# Altium project DAL_OBC_V10.PrjPcb (part 3 of 9)
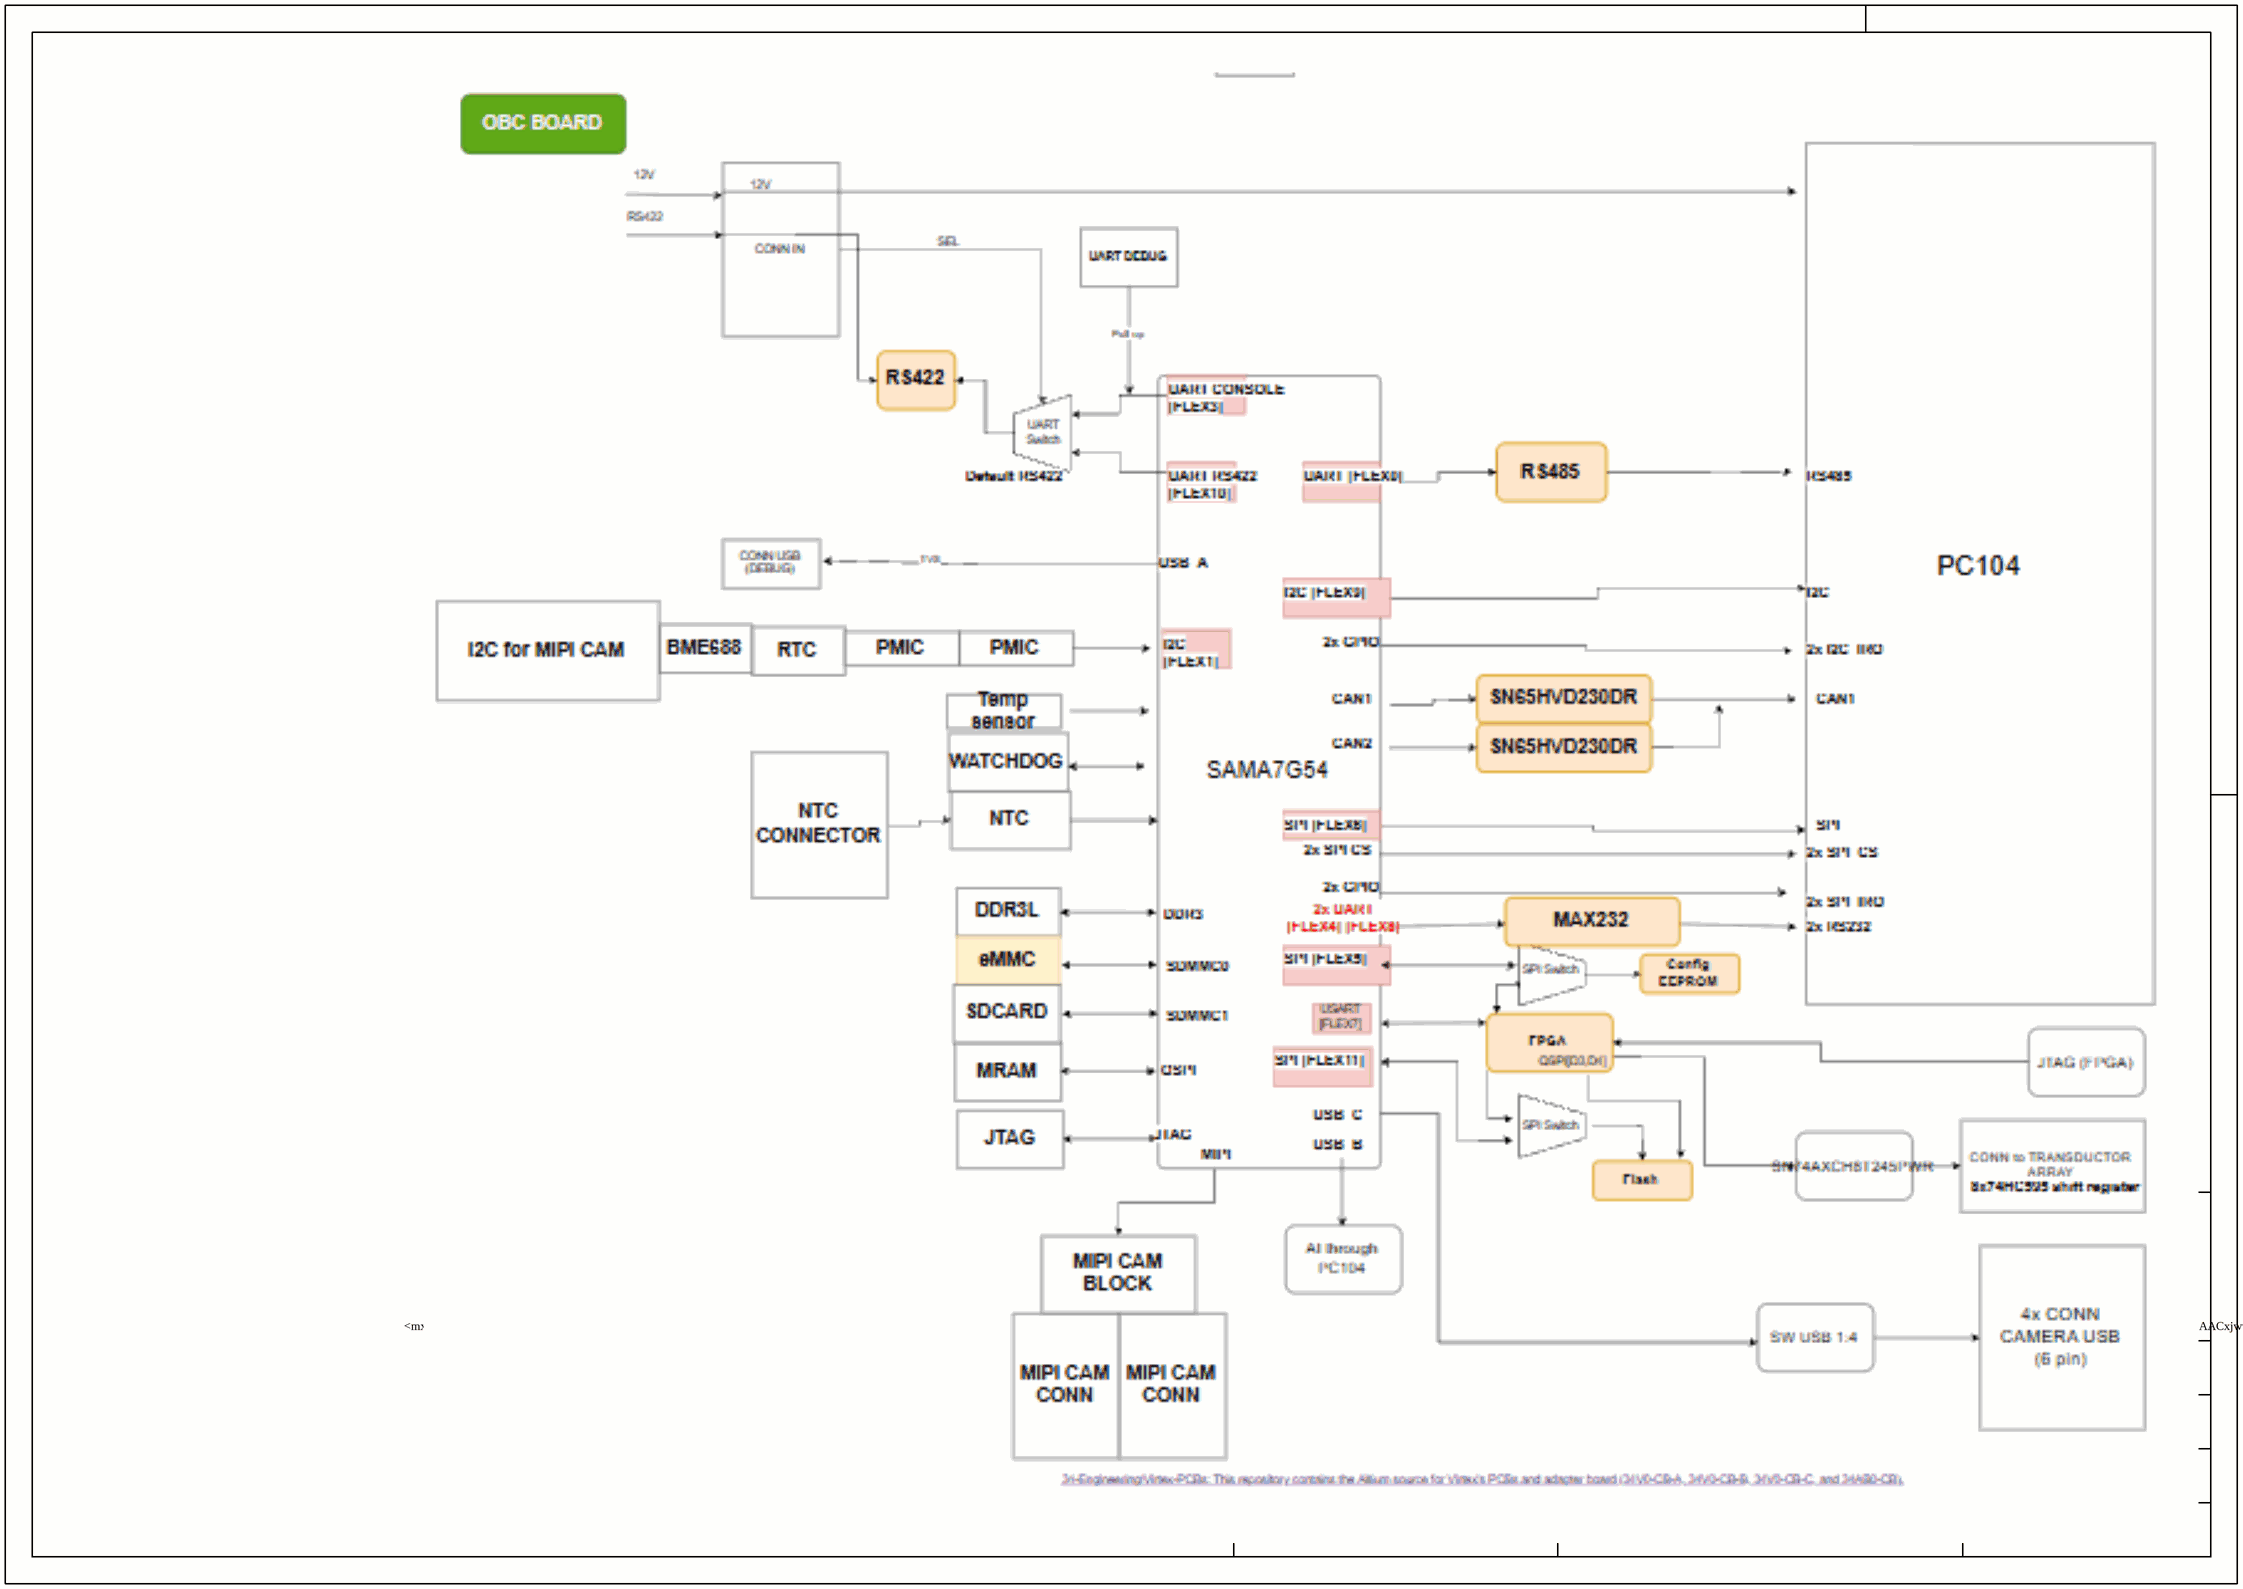
[diagram p36: BlockDiagram.SchDoc]

## Sheet BlockDiagram.SchDoc (continued)

### Notes on the sheet (continued)
JqvcTMV7Viu/XVq8e4P+ysQOpsY+cgftl/CTTGbK1QFBlSKSDqOwohJNKsQKHWWHbZzwsWz9ZQRYEslc7zK4TY5hW1xpJVG/St9bheu8T31fUY6Pg5Rfu2CP3aGnDN+aqy3LYfB0Pe8wbq2GzIe2Ubc1++foxoIiK6HAM1nyaiJixDdA2Yz69L36bTRERE5+Z7VrmQmmIiIiL6HnK8nnhEAiIionNiUExEREThOo9NTEREdNkYFBMREVGwamzirxlSioiIaGgMiomIiChQic+P3T87dWxGRER0udjRFtGJsQzRNWA+JyIiokvme1ZhTTERERERERFdLQbFREREREREdLUYFBMREREREdHVYlBMREREREREV2v0798/99fGO//995/9JyIiIiIiIqJv5d+/f/afAPY+TXR6LEN0DZjPiYiI6JL5nlXYfJqIiIiIiIiuFoNiIiIiIiIiuloMiomIiIiIiOhqMSgmIiIiIiKiq8WgmIiIiIiIiK4Wg2IiIiIiIiK6WgyKiYiIiIiI6GoxKCYiIiIiIqKrxaCYiIiIiIiIrhaDYiIiIiIiIrpaDIqJiIiIiIjoajEoJiIiIiIioqs1UFBcYhGNMBqFTdGitJbPkex/jxawf/Xrtu7RKEHesGx9u1y0bTXSalDmWCQRImsboyhCsshRhqxyr8yxSJJaWqNRhChKtunZyzjVj1mUtO5Jo3wRmdvT+RzaSpT5AklkpxshSjoes++iPLIM5El1DoPyL+rnPwrIxwf1vGNPh7xtL7qTJ/VlOk098ip9tfb8sy3nCRZ52ZiH6gLSNSZXnm9PI/i6fdbyDJT5wnmfOe5YBvoO97YoQdBh1M9X6/WlRL6ob+vX7veR+Q2oH7PWyVV2iIh+ANUiYBalVKYkoBA4ibRoXl6kyv7Vr9u6AaGM1WdS+02qTPvJJZO+/dAUmZLCXrd7ErJlnzuktU0v86fXcMxk2867FKkStbTaj2MjZ3r2JI7b1i+CkDKk73eXMqDlX29+1DmOcfjxdOcd9ySUdGyTXoaOmrocHzobhOTzTvkHuzzUdj1TR6Vbz5pd0hBKZrUEKmcqz0Uma2W5eXKXx8463I8u4t4Wcvz18+W5GIYeb08SW6fc75D9NTiOmXdylR0iou8BnmeVkdrO0Gg0GqFllt1byilWAAABKW/tGQz3T0vEY/0v2vIiRbGewfjZS19WIn2+x409i2GC2Fh5iUU0wXyz+6/MoJax9rumXCCazLGdVSJTSzjnNObbExDyFtsj84GP1cb4XaQF1jPHXucJounKkxbw8bHCxpyh5Tjq50vjXcYtT0aYbg8+hNjstsNzbHys4yZkiuenO0wAAAX+vL5gvjr8irRYw3XILk1QGdL3vct5yBOMtiegOQ9ZykWEySHD7wSv01/ePt/f8bYy86vMFPQiVeYJXt+1GQ70cmHmccP9E5bmBYQuQFA+b8k/+HzH+98PrA7lfKc1f7akW2PfB9CaxufnO97m/rx9cPLybN239oSAvK1KzcfHBzbWzcGfbotvem9rPE97+n41PQNo5wbY5ZGHe9zc7PLt2wr7bNu4zzjDfnvnc/Hn+zpX2SEi+h68zyp2lGwLmKXnW0rVc/k+y+4YNWdNb0ELlWpvdpvfBFtvXYVUaeFMUKkiU6kU2/lcCdo1ekKq5sqJQmX7tPaTK02lrGMmtTfWTfveREtHptrxOaam2Dy+TbUkhV6zf+z5PjOElKEz1SwZx/mocx9S3gqrNjg0P+hlJ3QZuhRB+Two/6htHkqtWjnv/KHp+oSkYeXtpvlOWp7NayUCahKLLD2U9eZ023y3e5vQ1tFyPWmtKQ67P21rgIXn93Psd4f8plTPZYmIvhd4nlUG+qb4mxvP8Cz3/9lg/uj4Jid/rd7KixRPjhfJAJAn2ltqkaJYLzEbN7xVHceYLdcoshTpvZ1gicWj9kZ+l1bzC9ox4uUaRSqqP61eAr6n+oWnw85v8PandYGDcvFyaB2QPt3ZP3djHd/fDW/Zx/ETDru4eUOHzSWYx1k8POHp4XAwO517vzHiZYZDkcIHPodKmq7EGPFsiXWR4nBF28zx2H5BO7Ex4id9m/6iMGc4uTzRa4gF0kJhvYy9NYPjeIblWqHIUjzc+eZs9u3ubbfP2n19hZfWBTzKP3gLuD9hHGO5XjfUEp9pv4mI6CgMineMh/jNHK9GTxI5kkOzKYH0d0PTpHKBl+qpoXk+yzieYWY/N+hBIiSywOZQ49nvKmjEBnNzR9zi+8O+b+avgZ1olPizf0oQDzjyOeug/Pw4/Fs83Hn2dYy7kwRy1yF/r/Lxw90Y47uHwwP+5u1P/WXQ0Sb4peXDv+eOHOhnGM/wWwsKwq9PJzS+0Zr1n/mFj3GPAWTW7ROScTzrNP/BN7236S8wNvPHrw0oz7jfRETUHYPigxjLrKrbWk2rHharGlEA8rnxoSJ/1d4Ce+YLUQUvgEifOnyfO8asej0OrN4DHiJjPB3uuiu8ty9g3ODlc9jN3af4W31AdXvjT80I5BhtdZDjkK32+XN8h+odw5A172PcOD8IJupmPHvWWh0EXp/O5hYtl6tBmfeYzP+d7IC+7b3NbgU2REB5ZOuAs+43ERF1xqBYpzfN3Te3Khd4rHrhQtb4FKIFHABkrclYF3pa2xq9TrSa39CaDD3QXL04mo8bSiwO1QYSvXZ1Z1JVK+IjZIP3Pj5btpUO8vfDy50qf+oPXAM9NAK1PPxr21sa0RH0l3bA6quj4vITh3Yt4teuI8BzMMtU2vQNz+C+973NaAV2bPNjo3XACtMkdKikvfPvNxERdcOg2DDG7LfZ3CrSvgGSmadHZf1BqW+gaKR1TE3EEU1Xu9QYat9XdXvjHaa19ld/QDnyrf01qmoqrPypP3ANVAthtK4YoHk9Xbex3uzgi1+E6bWmQ7SSCdb7vnCk735vM16qNPQZ0sp8MYPVFJNoO/5zkC/ZbyIi6uIEQfFf/Mlz5I1T4E3kKC3rDlm11dzqMCyCp3MtAEDx1xpiYSBH1USYTVfDal7Dawyrh8Ij3ng30GuqW9/mGw8YFET/JlDeWy8yYtxXUXG/5qlliTzRh3wK//6QqNHkV3V9aDXAfQBAUZYo9SlfIIn2Q9AB4ozNlwHrHnPUfeFI3/7eZjXBr/UZEmY8WyOTWi7crDCfTjDqEhzjvPvd3TBlh4joW7K7o7YFzFIfqsE7uYZ+6TMkQId1B6dtp+naZsuQQwUNkJY+bEh9eIim4x0yJE7TsvqQFU3L+pnD+Agl00xlRaGKolBFkaksrYYVqabj1nVOCClDJx3CRakirYb2cI7qoec55wx7dtnwTEK2lxtDSP6jS4WQfN54/WhhDGXjyhtd8mXTesPTaBsC6RTlWS/DzWW0fR8aF20ywP3oYIC0gu9t9o761t06JFOlyKyhwg6TULJpfCXfugMF73fn9NvzTN9tJyK6FPA8q5ygprjNMU2HzqxWE3ktvRy31xjqzWKHbjoYLwujl83VfIrpZILJZILJZIrpfI7VSaosfjqtp/Cm5o8DN6EWaQa1XvbqkIfoUm1WU0xGERJvk5YvULt31Z2ulvHCGcP5HT+81zheYq0KZKm0Wi9ssJpOMIqOaZ5NRERfbfigWKQolIJqnDzf5fbVtu6gIRCssQR3LmIokCO19eas04ewqHe4FRBc9TLGbDeWphR2Y0kBISTSrIBSWscpRzVFuzL6GJu1ptN75guRoDE9hUSaZciyDFmWQmpNCzfzKaKQNIi6aivzQ9wHGtIoikJrQrvBaj45Wz43vqtuMp7h96FMVlOqN/v9Qbrc2+xenPvd03fjaKv9/Ur7aTPH5MSBcbf97qAh33cqO0RE39TwQfE3Vy4eq7EEZYZMG6pomnhuofo3b307f+qdVglt2N9ufB1uacMwnaKDrb1xPMNyvbZuyGus10vM4rFZG3J7w5t0i/LPW9Ux0P3E/E5SmyZVVBw4ZvEv3MUx4jhGHM+wXK6hCr2jugl8RYYomP5d6xeW+fF4jHi5htKG7+sXXB3J05pjfCiT1XT3y56rg973I03vtHrc2wAgXqI6dYEv/1ps71eF9qywDYyN75a/er+JiKgVg2JDjldr+KVY76BjNW1+yDeGbOg5ZELvtApUw/52rdEd466Kio0Ot6rei4frYOso2gOy+Clj/RjnfEh6ngZW031zdMe070EIjhciocYzrPXxvmutDYi6M8Z4vYQybw3fV/vU5BTl+auG5el9P9L0TqvPvW1Lbw21mT/6O3UMNkY8W2sBtzV02AXsNxER+TEo1uTJ9PC9bFUTao2R2fiQbw6Z0O8b5J5paePRtjY1dDB66tzXSBi9Fz9/6bei+gPyyZqRfaUONQllW/WBnhc6OSLf7Vnf7h3T0ytRxRwn9zLKfIfegAcrz/onDv4RAobV835k6JlWz3sbsH1xp48wMeRxjLXWNubQYRew30RE5MWgeC9PDkNtABLPWtQ3nv0O6KBDr2Ht26TOSiuoKeteicUhegXEw90RTQ3r35eaTXC/8DW1Hpz/qDfm+kOTo+bJSf/G2117r79AkJnjGzF70ps/d8p3OjP/GjUmRB2ZY163DI13MU5Tno2gy9dyaVA/6d62FS+1filWL1iEvrU42mXsNxERNWNQDNRuOjKzOwML66DDqGHFCtPQzjbKvDbOoT2uojsQr8uTSfVNtBXcd2E0MXt7xGP1MfGXPpRWYySf9rvm87MCyWnizGMG7RtviAfUn6H1GrbAFwjGN+XH1/KarQ1axp0malDmiTbm9fA93h/P/MazXnt9ivJsN9sGVtPoLGXrJ93btvQWYBvMX96s349jNPO3gtfL2G8iImrCoBhW51pNQZ/VQYe7060YS/2jos0ckyhpHvC+zLFIIowmU8zf7VfVZrPtzXyCKFn404pGWm23K7jvwAiONlUg+mVvqUtz/0SK3z/s4aD+4Nmcd8pFhJF2sp3BgtbkLvwFwlC1vGZTz87NBenKlciTyPzOXWZYhmXiEyuRJ9o9o+GF0+DlGdi+oF1rtZzYYD6JkCxyT5Baovhr/62rH3Rv2zFbgFX3OJc8GWEUJcjLpo3cnsNqG101/Zex30RE5DZSSin7j7rRaISWWQDkSEa773FFiqJzt/3a8hCQ0t9Fyf3TEvFhBfq6JdLne9wYc9dN4ljbPnPdabFu/l62XCCa7Gsqm+ctF5FRu7ElIOTtrrOND3ysrJuwzKAcT3x5EmFqD84rBOSt1m3Hxwobe5a0wNq1cUDw+arvh0TWOKRWiUW0f6Ptm69JtU1CSjz8usfNDQB84v39DSvjGDQf+0sUVoZ28sR4OAas8/3xgZV1soXMsK7lHf18dDxeRj63z2VY3gHa0nHRy2LI/HRJwvJ527XecW3E9vpYLPXrtq3vfQBBaXx+vuNtvjK2T2aqOVgfrDxbjLKlMe4NH/j42HS8N/jV7wnAxd7bGtZrcJ2f2nL6tXRLCIFb7Tib9yf/Np58v53lyjTsMxQR0ffhfVZRLQJmUUplSgIKgIJIVWH/3EpbPmCS2fHLAkKl2gZmUvvNTNjJmN+zr0Umlait2z0J2ZyOUkoVaXhaEFKlmS811eF8WcfWe3wKlYr9vFL55nQLPI9CqtbduzAIKkOaIlXycCx9k1BSz8y6Iq3yjPccu+jn0lPeWtP1peOi54Fj8hB9pbB8HljOD5NQMqjAd0+3XnS6pxG0bUOUZ6dCZVI40mme2u41Ib7Nva39glO7RjUtl6WhxznsHJ50vwOmxmt60OQqO0RE3wM8zyrNv+z4Fq50eVB2cdyYPJN5Qe+2rHFBNwKH0IfwTHvAabs5FKrIUiWFqN0AhZBKppkqvMvrmtOCEErINODGuWc+OPiWqh662vf1cB5EGngsLUWmUimVsM/nbv+y8IN1URBUhmzN51sIsc079iK6TFbz+0+cU6E/BBoFrmNZ17bD9bBpynq+WKGvFJbP26/XovP1TAWla06u61lIGkKJXZBSW9yrZ3n2KlSWutPeXjuP2d42vv25nHtbGP2e7rleFoXKUunczuPO4ZD7HZJ3q2mwZygiom8GnmeVgZpPE1ETliG6BsznREREdMl8zyrsaIuIiIiIiIiuFoNiIiIiIiIiuloMiomIiIiIiOhqMSgmIiIiIiKiq8WgmIiIiIiIiK4Wg2IiIiIiIiK6WgyKiYiIiIiI6GoxKCYiIiIiIqKrxaCYiIiIiIiIrtbo379/yv6j7r///rP/RERERERERPSt/Pv3z/4TAGCklPIGxaPRCC2zEJEHyxBdA+ZzIiIiumS+ZxU2nyYiIiIiIqKrxaCYiIiIiIiIrhaDYiIiIiIiIrpaDIqJiIiIiIjoajEoJiIiIiIioqvFoJiIiIiIiIiuFoNiIiIiIiIiuloMiomIiIiIiOhqMSgmIiIiIiKiq8WgmIiI6MTKRYTRaITRKMKitH+lofA4ExHRMRgUExERnVSJP2+b3b9vcTO2fqaB8DgTEdFxGBQTERGdUvkHh1hN3iO2fqaB8DgTEf3/9u5fyU2dDQP448v4Tu3dIpMrkK/AmyZV2u2gtJt0KdOlwaXdpd1qmwNXYF/BToqFOucy9BX+gwSSECAwXj+/GWaStZHFiyRLWAjqKNCguMBmMTtNWWreFrU5TRni8+uLDaqvurX77NksRmbZt54vEyWvWloWRYZNvMCiksfFYoF4k6Hw+cizIsMmjmtpzWYLLBbxMb3qPkb1mC3ixiOxyi7T1U5b63PoUmAT95gOd46/IV6brG1iQ2pRByzlYLFYIM4K9742IcspkVW97alulzJX3fUki+v7tNqa2roB6kLx7wvKsVp1qNYUk7K9cn90PZ1x2vUWbZeKcQZuNM69dM1P0fH4s7j8DGMHon4+q1tTmxRWPT/jlC8DS1+jd59zEfv15dRzbo2BvVwM+l0xVGwMW/vyVyDb1PPWWMcIkA083iKlTGUESHhuIsnt+4tEVl91a/fZgJDax6eR8lokU+UlkzRyHYciT2Ukqp9t3kTUcMwt0jqml7rTs8Qsajp4kzyRopZWcxx95GlUSbty7pxymUaidoy1rXV5aw9t65AtT77lQEQyNSZg4JumTzmlu4a25bxxEzIyVHi1De609a1fretCU91uFxNDSE7M6QzfrjcdXwXjXLrJOHfUNz9qrHyO/0zp45n7bObzad7MbVJY5vwMX74ULc4VuvY5fc6hmn9rAOz1YpDvijFiY92ay1+932zerOG8A3D0VWby+Aar2WyGhrecrtQ8YQcAEIiiz9U3aL5+32Kp3euj7C8S5PsV/G8FUveNkPz4isfqWzQPWGofXmCzeMD6cnk5hdxWrzCfFBssHtanK9ERUrk1T8/S3ncmIKLPOEbmDW+7g/a6SHLsV4ajzmIsnnaOtIC3tx0O+hsa4qieL4VzH7MsnuHpGHwIcTjlwxEbLwWy+BlPu9pBIcn3MIWpqswXTvH6hh9fHwG84/31BWs1bdc5D6B1HbKcB/2YACEifP4MY3mypaEJWU7p7rUv5/X2+v31FS87vb2LUgm1ehZZjF+vyhsu1PKqt5Gar9+x1b+Ahq0LWYzZqeKa93HF5NhevWifbWsHr9WuN7ddF4yz5ibj3EWI/KhpNB2/qle58GuTwrpW+ToZsc/ZGEf1nFv7afZ6Efy7YujY9C1/SlkHTul9+4rHRwDvr3h92eHc9TXXhfvg7KtUR8lVHm9xXqnx02f/PvueaFfTbFeIc5koV4fsV1kqV31EJJPcmKCUeSqT86+ZpgSrV/mcvwAafhk1pSllJWaRctXLduw2SjpRosTH40qkTZ7oV+FEIpPL1T7P/FV//TftU4mtNVQBIFAdSiNxKgOmV+vn331MAcspUcByfizLStn0bk/UMu27jxy8LpTHYmu//GKifv+Y33etdt0n/5JxrrnNOLcXKD9j/FJsTbdrm9TFtcpXvV80TJ9TKJ/hyIus5Mcrbdv5q1LLZEMezkaJjS3/PuVPb7vMZf1YxyIh7K/fATj6KvZXTlw7l3xOqkuf/fvsW9IKnCkddaBlev2kMR2DPE1kUivhPl/OdXmiVkRbI1qJWeOXhln5WUImuZpfU4X1oTZU5TSR5s6OyvfiRSVWrjf2hFHqkKwdu+uYwpVToqOw5VxvC5rrvezW0Rm8Lvgcr897pEdMrtWu++WfcdbdZpzbC5afqw6KpUe5COVa5WukPmeUtrgNUTnn1v6M7/lTtf2uGCk2znQbyl/X+nGH4OirBFpo6/Yttymi838Oa/zS7q/PEF+mJAgkvy3TIIoNfl5mLjjeVzFfrrCqToXIfpVTuhEhtU690M1Xv5GI8/8OWOsHYrb8ejn2w/pX8+JhAKA++kJ8wxefzPkSEdJ8j22XqR3q6qMiwfdqXBXzL99wCdXu1fO4p2yOL98uRwS8vZsXZghZTokG8YBPSjv2J9dfDWboupC9XqYMim9fvNK2W+Jr+SWFl3+Ntbs0pXadca640Ti3NbX89DJSm1Q1Vvkasc+5/J5c+l6H9bPfolvXNGJs7K5U/u4MB8UXS2zTyzchdk/lytLF5md5L0T0w3CP0VH2S7lnxvE+H9lreV+ASL7b7/+omWP1ozwOv8HeEt8vNXeH1+YdtEYi+uHXQDRb4nuaI99X7zlvIf9TnoPPj+58zb+gHEO+4X3qDXNbluMPWU6JhjHHo/Emr7CGrgtlOx7hR4DEH8pekYeptOuMc82NxrmtqeWnn3HapLpxyteofc75CuUufQeLwxs1NlYtyt/hDzhm7oaDYtXyu3JVZ4efmwIoNnguV+FCary7HQAyKPXG8DiINtS0BL55XeZTKFcWfQd76q+mu59NS/YX2Fwu/0bodagV8+XcqwG3Kd7fLv8Wnx601+rURuZjXHnL/1y6IBYhyynRUPQ2sLEqdzJwXVB/JYvCPDO3uX7rptGuM866G41za1PLT19jtElmw5ev8fuc2uzM3c8J/1o8fmzMGsrf/FFZLGyHp7jNI5zojINizRyr3/q0jsVzeaUzSh0r9hXvKIdjvg2RhZbWZzy2rIOdplmov5oeXuCcMaZMUW531Wx4amfmc8vAvXVvrSbCoxMSspwSDUSbneM7/a+tgeuC+5m5XRRQrvn5tW9TaNcZZ92Nxrm1qeWnp1HaJJuhy9c1+pzaL+AHrJ+bBvtXcpXY1DWXPzWeAHZPeDg9d538DTAo/oN/swyZdRvyBDV8ts9HV6Z1XJZWb7g/VZu2G5L4hOoFoWb6NAu/wZ46zcM9naWcEtXhqtnEtJsmN3HKfXXWTshQ5ZQohKJAFi/wcJmd438fYmuD1gXlnj5bXWxLXS/BO80JtOuMs+Y249zB1PLT1ZhtktWI5Wu0PicwX/1wrOUzQSPG5qJF+Zuv9kgjpU972GH99IAZB8fewg+KDzusn57wZN0GvKm+6bM9r0Rp0zoAZyE06lRxFNf6MlGneVjvfVB+jTRerbom9Qq/YXrJh6YuBud5hbhvOSXq47DGw2yGmbo9PJTPJxeR5TmxAwhdF9SBVYgpvUWGWH3Oa5s0p9SuM863Gee+ppYfmym1SVVDlq9r9Tmra/k0Tg2/gjFjE6D8Lbd75GlULiILZXA8WyDm4Ngp/KC4UZfpByPTpksAXitQfgjqqpvmBR3UKRy+CzjQ8LL49PB3ABAJfrtaTaKJE0kKud86v/ynrPuU3upspw3ieIHZg16/c+vaFiYft11nnGks12+TPmj5UtfyOazxPNivZretTfmbL7fYyxxpUhkc44Dd0wNmiwlefJiI8INikSA/Pv/Ysjnuy+2r6bO9llEvsFHuIz7zXwp/erzuiTpRl8qvX7UbYKpaUB9v4SwfxWaB8kdi/8cFEF2ViJCkKdI0RZomiJRpX4f1ExY32znK8Os81a3ptpuq2mynNXbnXwkAiChB3qF+33a7bsM4U2ATb5NupXy16XNWV2i+5b62D2dsgpa/OZarLfZSIk8TqLOqcVjjgQNjo/CD4htXbJ7L55FFKVJlKfyn2FFVHz6VV2T6LofeOy19oZBWXAs6KMv8e03PvTHOxmqqsli/1yRvuOjUu2wRhfIJX5ZLLJdLLJcrbLd7yFxd6PABria3t6HqQtBn5gIQAiJKkOYS+237gRpw5XadcT661Th3NbX8eLlym9RkqPLV+1z16HMCwHKLchb16ckvUzFqbIYpf/PlCtt9roxncBv3cF8BB8Ua5crz6fFLS3UhgN2TvUBqy6H3WXY9RFo5ykWY214xnONL2epqCzqUz2rruIDDCNSFs3wWNGj76I1JyWLMLj8Ri8Z7TYAQZYtoQPMV9mPdYzZQXejVTppmO+332G9X3Z/dDly3XWecgb759TFQnDsLnR8tvRGN2SY1Gqh89T5XffqcR+qv4If1gGsPtXXt2AQrf3MsV3vl4gOwM83Bv3McFCvU+zLLK236Muf2Aqkvu97vHuSeaamrEHdY4EJbEfC8oIP2LMgfzYOvCTg0zp++4YW5shgLZUAcpR4DYqB/2SIaWuUes+GuZg9RFzoudDOC67XrjPPtxrmPAfPT4he7wv9nOrvR2qRmw5SvnueqZ58TOA7+1Ce/uFbYHtcEYhOw/C3LG9OBt3fLeOZ+cVB8lsXafZk/lFZlvvrtsRCAegWv730RlbRe/m1RcNUHt3edVqYv6PBzU/RY0GRc6kPuGyu8unLpxDpWTsUGi6fd5bELUbqH/3owIcsp0RD0Mjrc1ewB6kLoKb1BXatdZ5xvNs69hM6POjgxLzRVp95n2+EX1Iux2iQfQ5Sva/c5j7Qnv+x+YuN75WNQU4jNlMrfx8ZBMVAruFFavS/TbyEA7QoednjyvZG9yGrPEKs+v808EK/L4ofynujK4L4NbSrLyzOeuy5oMjZ1qkvDFTX1i6R7YzWyYoOF8siQdgPio5DllGgI+q8hPwebShe6LpRTGLu3vUO6VrvOON9mnPsKm5/KwOApNvbDNMp9tn0vfI/VJvkYonxdu895pM7MPGD986Xy+nVMITahyl/Zdt5Qv3dEHBSjsriWrVGpLARgXnRLf+bacYW3GLW2/azIsDk9BmL9Wr0kpk/bPqwfsIg37rQWM+XXbtPgvgVtQYfDDQ0eK9PdLV+chbZAVb/GajS1AXHeekB8FLKcEg1B/TWkw5Q1bwHrgjaFscXzbcd0tXadccatxTmIsPmpD7LtaRWbhbLmRohHFI3VJnkYpHxduc95os/MLI/tuqYQG3f5y+IZZosYWWHLVPVJJX1mTnxgsoHHW6SUqYwACUBCJDKvvtxI2R9CRlHk3FLtA9TPjmSSpjJt2PT86Z+duDKfJ1J4vDdPxOk96iakuByDUNI5bVFaTUZKKWUaGdISeoyEqH4WpLBlTkrv81U/jkiacymllLlMLvlwvc8tN5yvMl0ho6TyujHz6jk97iei5LRPIiOhH5cl9MEgSB1S41svA7YtMQdISuP5PceqfTklClPOFVp769OmqPXe5/2lEHVBTaNdNWkREye/dOrH6oqVT7vu97nS+NmM89H04hxS0PykUT0t9fuw8v0OQApbWlK2imv7NqkLv/zUY+rKj0/5Ohq8z+k8Fyemc2zdzy9eum7fFYPHpin/1vJX6R8CUmj5qufbnaePDY6+iv2VE9fOpRYn1UgtoM2bXjfa7VsdzKaR8pq10pW09zuONU+jeiNv2URkT0dKKfPEP63jhQFXarLF+arE1hkf/0bXru25dOQ/T2VkaJz0TcioMVb9IUgd6hAba1qlkOWU7huClHOV/kXvbH6k7NzROetXF/q0f21i4uKbTuh23fdzjxhnE5/j8v3co35xDi9ofvLE4/sdpwvpzpRaxrVtm9SFb35Cl6/SoH1OZz7P6oM8+36+8VJ1/64YNDaN+beXv7R2kcS2+dSJjw2OvspEpk+rCyi01WNfdRqWOD6Cqclym5YPwa4+J04xX26xl/npodmiXPzpRIgIUZIi93gm4nzlTuv8fMUkzSH3W6zaPFPi82P1L4olvl4OViAxzis3EJ+qf/HU41xWzZfY7nPkaQQhKokKcYr9Hts2sbqyTrH5/OguWwHLKVFY+loOPouLdKojJ73qgrpo3xSm9E6qXdcxzg2mEOcBBM3P/PjcVXtap+94ucc26K1R7dukXq5Uvgbtc3qZY7VX+toARODHg3T9rrhubOzlb7naQ+Y50iQy5mu4OvGxzORx1Gw1m83Q8BYicmAdontwz+W82CwuaxREqex4rz81YZyJiKgPV19lIr8UExER3aIMvwKs/kpNGGciIhoOB8VERERdTfqZuR8I40xERAPioJiIiKij8rmPfMTFkBhnIiIaEgfFREREnRR4fzv9U3wDx2pDYZzHkSGezTDruS02lhVIPyTGjOij4KCYiIiokzlWewkpJeS+YcVc6oFxJiKiYXH1aaKBsQ7RPWA5JyIioilz9VX4SzERERERERHdLQ6KiYiIiIiI6G5xUExERERERER3a/b371/zxOqTf/75p/onIiIiIiIiopvy9+/f6p8An4W2/vvvP/zvf/+r/pmIPLEO0T1gOSciIqIpc/VVOH2aiIiIiIiI7hYHxURERERERHS3OCgmIiIiIiKiu8VBMREREREREd0tDoqJiIiIiIjobnFQTERERERERHeLg2IiIiIiIiK6WxwUExERERER0d3ioJiIiIiIiIju1v8BdRxHBGg25tMAAAAASUVORK5CYII=;" value="" vertex="1"><mxGeometry height="614" width="1034.06" x="738" y="1685" as="geometry"/></mxCell></root></mxGraphModel>

## Sheet Power.SchDoc
size 420 x 297 mm; SheetNumber: 5; SheetTotal: 34
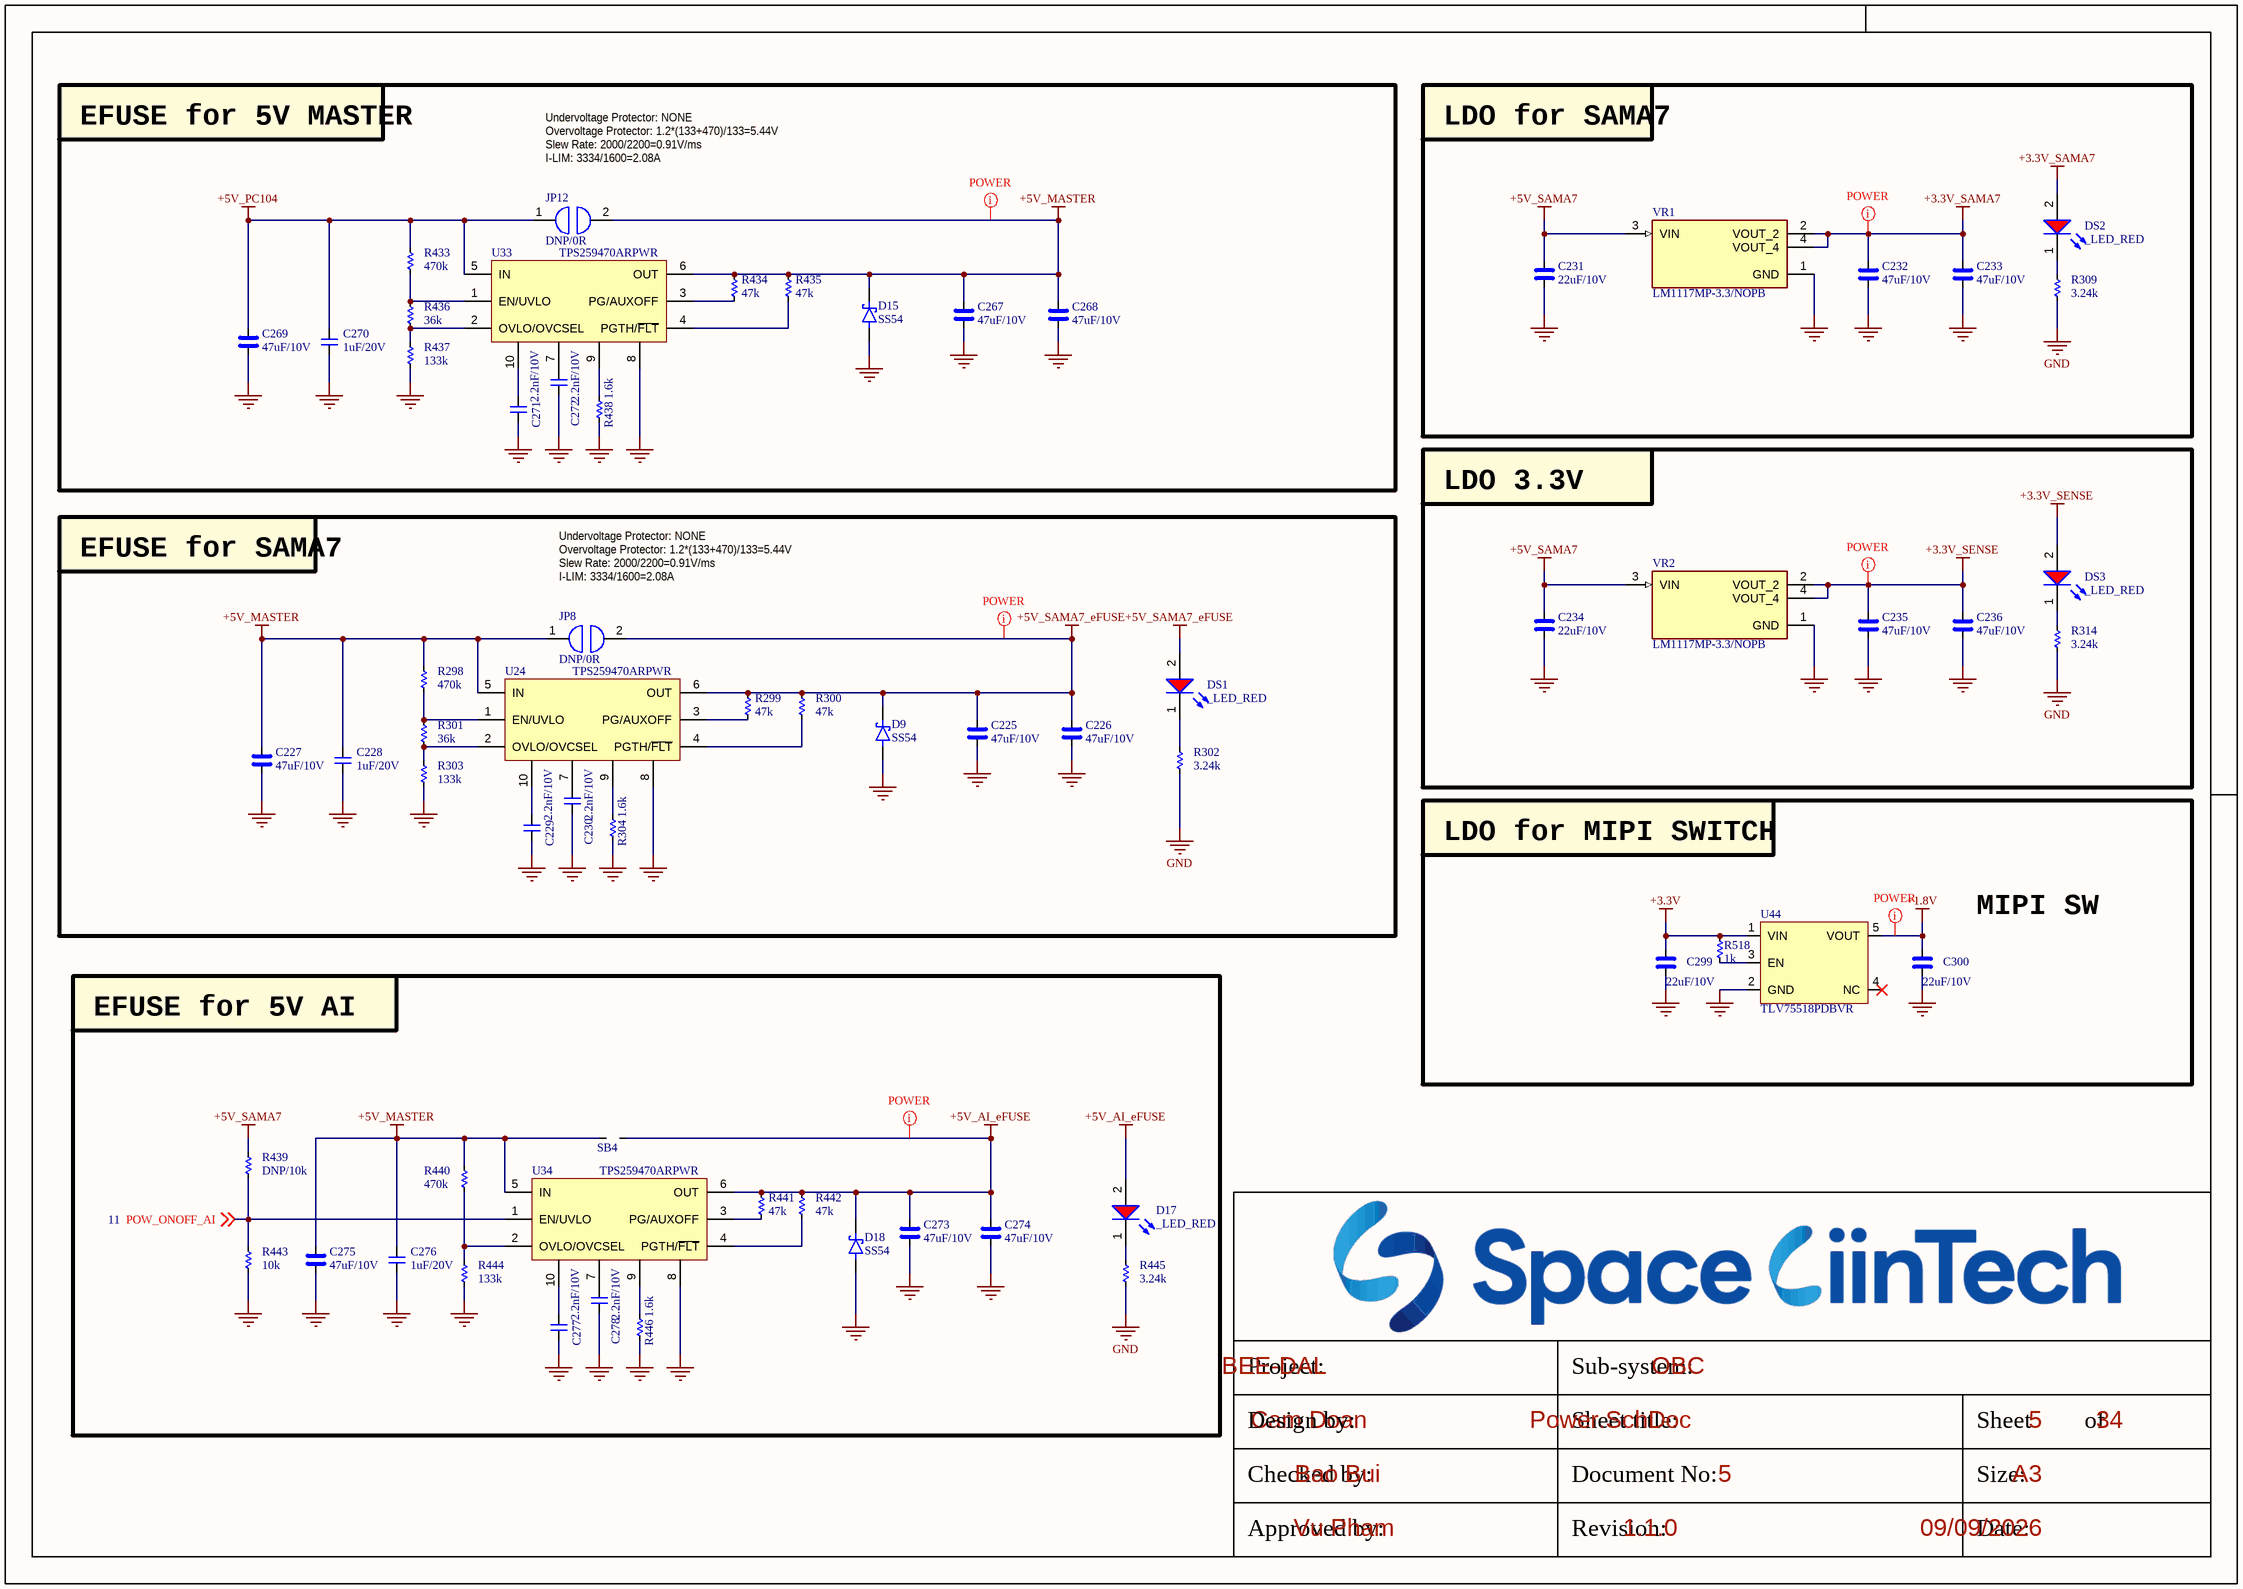
[diagram p4: Power.SchDoc]

### Parts
C225  47uF/10V  [CAP_C_3225X80]
C226  47uF/10V  [CAP_C_3225X80]
C227  47uF/10V  [CAP_C_3225X80]
C228  1uF/20V  [CAP_C_1005X50_L]
C229  2.2nF/10V  [CAP_C_1005X50_L]
C230  2.2nF/10V  [CAP_C_1005X50_L]
C231  22uF/10V  [CAP_C_1608X80]
C232  47uF/10V  [CAP_C_3225X80]
C233  47uF/10V  [CAP_C_3225X80]
C234  22uF/10V  [CAP_C_1608X80]
C235  47uF/10V  [CAP_C_3225X80]
C236  47uF/10V  [CAP_C_3225X80]
C267  47uF/10V  [CAP_C_3225X80]
C268  47uF/10V  [CAP_C_3225X80]
C269  47uF/10V  [CAP_C_3225X80]
C270  1uF/20V  [CAP_C_1005X50_L]
C271  2.2nF/10V  [CAP_C_1005X50_L]
C272  2.2nF/10V  [CAP_C_1005X50_L]
C273  47uF/10V  [CAP_C_3225X80]
C274  47uF/10V  [CAP_C_3225X80]
C275  47uF/10V  [CAP_C_3225X80]
C276  1uF/20V  [CAP_C_1005X50_L]
C277  2.2nF/10V  [CAP_C_1005X50_L]
C278  2.2nF/10V  [CAP_C_1005X50_L]
C299  22uF/10V  [CAP_C_1608X80]
C300  22uF/10V  [CAP_C_1608X80]
D9  SS54  [DO-214AC_SMA]
D15  SS54  [DO-214AC_SMA]
D17  _LED_RED  [LED_0603]
D18  SS54  [DO-214AC_SMA]
DS1  _LED_RED  [LED_0603]
DS2  _LED_RED  [LED_0603]
DS3  _LED_RED  [LED_0603]
JP8  DNP/0R  [JUMPER_1608]
JP12  DNP/0R  [JUMPER_1608]
R298  470k  [RES_C_1005x30_L]
R299  47k  [RES_C_1005x30_L]
R300  47k  [RES_C_1005x30_L]
R301  36k  [RES_C_1005x30_L]
R302  3.24k  [RES_C_1005x30_L]
R303  133k  [RES_C_1005x30_L]
R304  1.6k  [RES_C_1005x30_L]
R309  3.24k  [RES_C_1005x30_L]
R314  3.24k  [RES_C_1005x30_L]
R433  470k  [RES_C_1005x30_L]
R434  47k  [RES_C_1005x30_L]
R435  47k  [RES_C_1005x30_L]
R436  36k  [RES_C_1005x30_L]
R437  133k  [RES_C_1005x30_L]
R438  1.6k  [RES_C_1005x30_L]
R439  DNP/10k  [RES_C_1005x30_L]
R440  470k  [RES_C_1005x30_L]
R441  47k  [RES_C_1005x30_L]
R442  47k  [RES_C_1005x30_L]
R443  10k  [RES_C_1005x30_L]
R444  133k  [RES_C_1005x30_L]
R445  3.24k  [RES_C_1005x30_L]
R446  1.6k  [RES_C_1005x30_L]
R518  1k  [RES_C_1005x30_L]
SB4  JUMPER  [JUMPER_1608]  (value not drawn)
U24  TPS259470ARPWR  [VQFN-HR-10]
U33  TPS259470ARPWR  [VQFN-HR-10]
U34  TPS259470ARPWR  [VQFN-HR-10]
U44  TLV75518PDBVR  [SOT25]
VR1  LM1117MP-3.3/NOPB  [VREG_LM1117MP-3.3/NOPB]
VR2  LM1117MP-3.3/NOPB  [VREG_LM1117MP-3.3/NOPB]

### Blocks framed on the sheet
EFUSE for 5V MASTER: C267-C272 D15 JP12 R433-R438 U33
LDO for SAMA7: C231-C233 DS2 R309 VR1
LDO 3.3V: C234-C236 DS3 R314 VR2
EFUSE for SAMA7: C225-C230 D9 DS1 JP8 R298-R304 U24
EFUSE for 5V AI: C273-C278 D17 D18 R439-R446 SB4 U34

### Nets
+1.8V: C300.1 U44.5(VOUT)
+3.3V: C299.1 R518.2 U44.1(VIN)
+3.3V_SAMA7: C232.2 C233.2 DS2.2(A) VR1.2(VOUT_2) VR1.4(VOUT_4)
+3.3V_SENSE: C235.2 C236.2 DS3.2(A) VR2.2(VOUT_2) VR2.4(VOUT_4)
+5V_AI_eFUSE: C273.2 C274.2 D17.2(A) D18.1(K) R441.2 R442.2 SB4.2 U34.6(OUT)
+5V_MASTER: C227.2 C228.2 C267.2 C268.2 C275.2 C276.2 D15.1(K) JP8.1 JP12.2 R298.2 R434.2 R435.2 R440.2 SB4.1 U24.5(IN) U33.6(OUT) U34.5(IN)
+5V_PC104: C269.2 C270.2 JP12.1 R433.2 U33.5(IN)
+5V_SAMA7: C231.1 C234.1 R439.1 VR1.3(VIN) VR2.3(VIN)
+5V_SAMA7_eFUSE: C225.2 C226.2 D9.1(K) DS1.2(A) JP8.2 R299.2 R300.2 U24.6(OUT)
GND: C225.1 C226.1 C227.1 C228.1 C229.1 C230.1 C231.2 C232.1 C233.1 C234.2 C235.1 C236.1 C267.1 C268.1 C269.1 C270.1 C271.1 C272.1 C273.1 C274.1 C275.1 C276.1 C277.1 C278.1 C299.2 C300.2 D9.2(A) D15.2(A) D18.2(A) R302.1 R303.1 R304.1 R309.1 R314.1 R437.1 R438.1 R443.2 R444.1 R445.1 R446.1 U24.8 U33.8 U34.8 U44.2(GND) VR1.1(GND) VR2.1(GND)  [project net AGND]
POW_ONOFF_AI: R439.2 R443.1 U34.1(EN/UVLO) ; off-sheet POW_ONOFF_AI
NetC229_2: C229.2 U24.10
NetC230_2: C230.2 U24.7
NetC271_2: C271.2 U33.10
NetC272_2: C272.2 U33.7
NetC277_2: C277.2 U34.10
NetC278_2: C278.2 U34.7
NetD17_1: D17.1(K) R445.2
NetDS1_1: DS1.1(K) R302.2
NetDS2_1: DS2.1(K) R309.2
NetDS3_1: DS3.1(K) R314.2
NetR298_1: R298.1 R301.2 U24.1(EN/UVLO)
NetR299_1: R299.1 U24.3(PG/AUXOFF)
NetR300_1: R300.1 U24.4(PGTH/~{FLT})
NetR301_1: R301.1 R303.2 U24.2(OVLO/OVCSEL)
NetR304_2: R304.2 U24.9
NetR433_1: R433.1 R436.2 U33.1(EN/UVLO)
NetR434_1: R434.1 U33.3(PG/AUXOFF)
NetR435_1: R435.1 U33.4(PGTH/~{FLT})
NetR436_1: R436.1 R437.2 U33.2(OVLO/OVCSEL)
NetR438_2: R438.2 U33.9
NetR440_1: R440.1 R444.2 U34.2(OVLO/OVCSEL)
NetR441_1: R441.1 U34.3(PG/AUXOFF)
NetR442_1: R442.1 U34.4(PGTH/~{FLT})
NetR446_2: R446.2 U34.9
NetR518_1: R518.1 U44.3(EN)

Not connected (* = marked no-connect by the designer): U44 4(NC)*

### Layout directives
net class POWER: +1.8V, +3.3V_SAMA7, +3.3V_SENSE, +5V_AI_eFUSE, +5V_MASTER, +5V_SAMA7_eFUSE

### Notes on the sheet
- Undervoltage Protector: NONE
- Overvoltage Protector: 1.2*(133+470)/133=5.44V
- Slew Rate: 2000/2200=0.91V/ms
- I-LIM: 3334/1600=2.08A
- LDO for MIPI SWITCH
- MIPI SW
- Project:
- Sub-system:
- Design by:
- Sheet title:
- Sheet
- of
- Checked by:
- Approved by:
- Revision:
- Document No:
- Size:
- Date:
- A3

### Library data of the parts
C225-C227 C231-C236 C267-C269 = _CAP_C_High_2: CAP High Value
C228-C230 C270-C272 = _CAP_C_2: CAP
C273-C275 C299 C300 = _CAP_C_High_2: CAP CHIP High Value
C276-C278 = _CAP_C_2: CAP CHIP
D9 D15 D18 = DIODE SCHOTTKY
D17 = LED_RED: LED RED CLEAR 0603 SMD
JP8 JP12 = JUMPER
R298-R304 R309 R314 R433-R446 R518 = _RES_B_2: RES
U44 = IC_POWER_AP7347DQ
VR1 VR2 = LM1117MP-3.3/NOPB: 800-mA 15-V linear voltage regulator; MF: Texas Instruments; SnapEDA_Link: https://www.snapeda.com/parts/LM1117MP-3.3/NOPB/Texas+Instruments/view-part/?ref=snap; Package: SOT-223-4 Texas Instruments; Value: *; MP: LM1117MP-3.3/NOPB; Check_prices: https://www.snapeda.com/parts/LM1117MP-3.3/NOPB/Texas+Instruments/view-part/?ref=eda

## Sheet POWER_MANAGER.SchDoc
size 420 x 297 mm; SheetNumber: 6; SheetTotal: 34
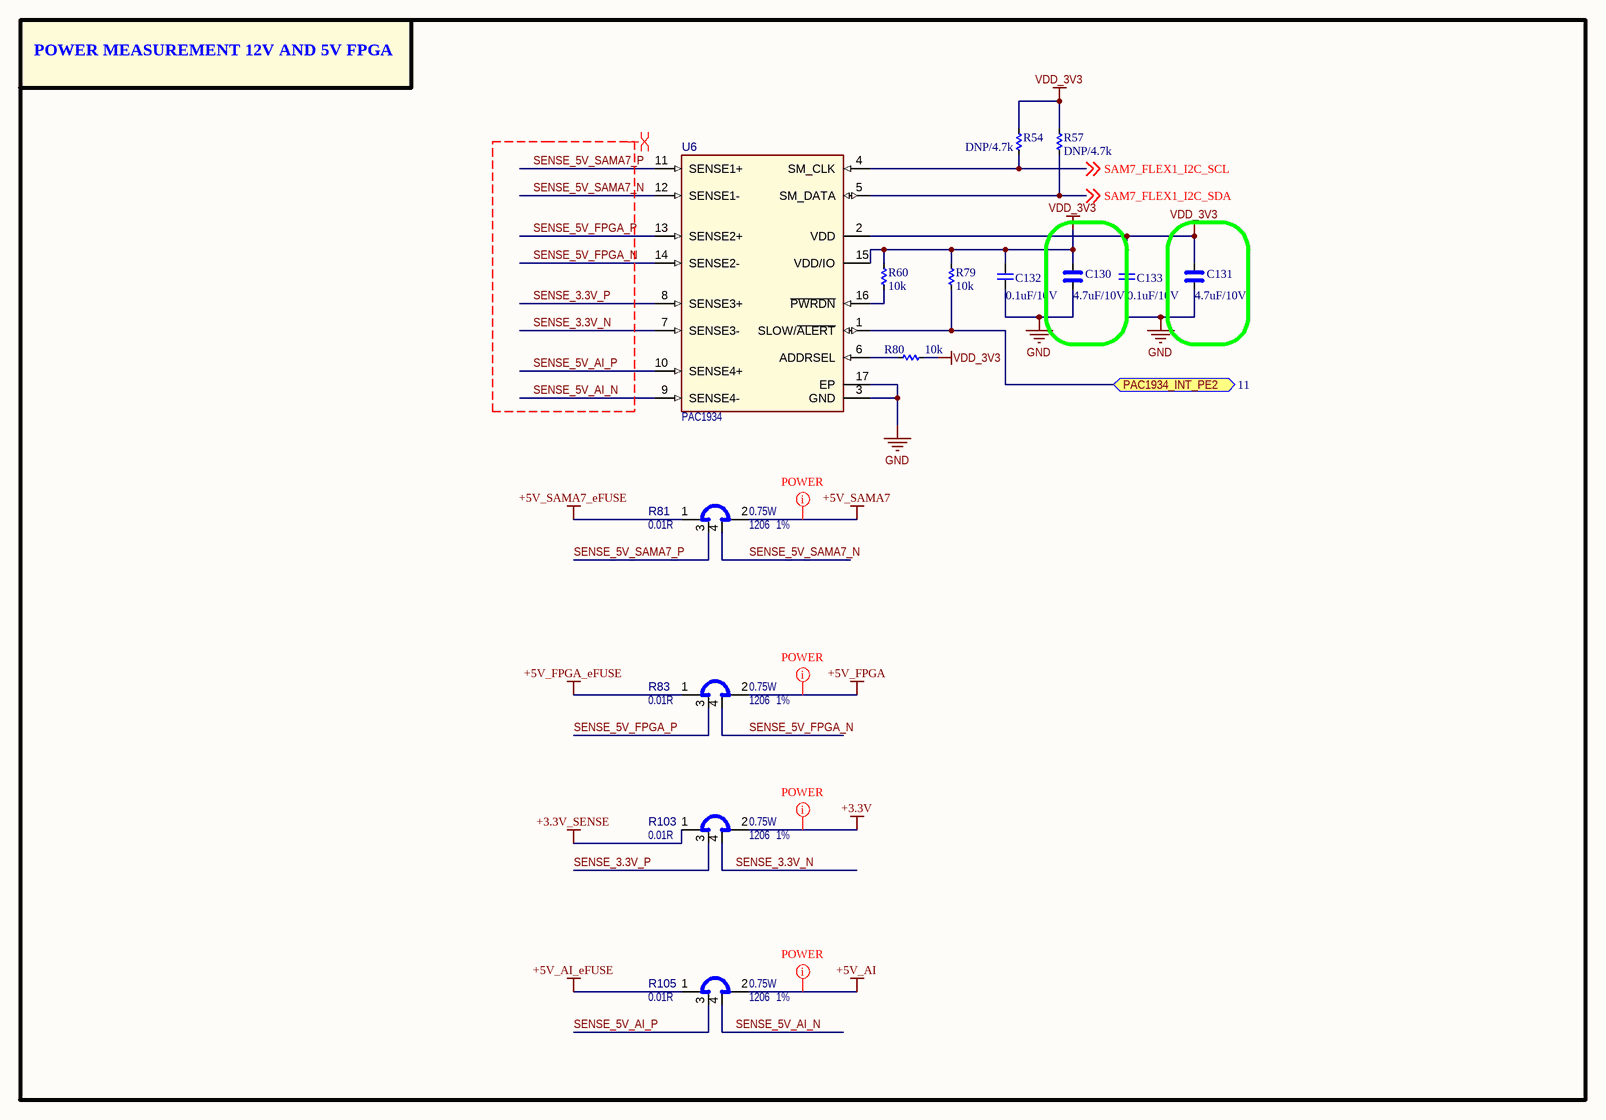
[diagram p5: POWER_MANAGER.SchDoc]

### Parts
(Parts that share a designator on the sheet are numbered #1, #2 ... from top to bottom, then left to right.)
C130  4.7uF/10V  [CAP_C_1005X50_L]
C131  4.7uF/10V  [CAP_C_1005X50_L]
C132  0.1uF/10V  [CAP_C_1005X50_L]
C133  0.1uF/10V  [CAP_C_1005X50_L]
R54  DNP/4.7k  [RES_C_1005x30_L]
R57  DNP/4.7k  [RES_C_1005x30_L]
R60  10k  [RES_C_1005x30_L]
R79  10k  [RES_C_1005x30_L]
R80#1  10k  [RES_C_1005x30_L]
R81#1  value 0.01R  Package: 1206  Tolerance: 1%  Power: 0.75W  [RES_C_1206_SHUNT]  (hidden comment: KRL1632E-M-R010-F-T5)
R83  value 0.01R  Package: 1206  Tolerance: 1%  Power: 0.75W  [RES_C_1206_SHUNT]  (hidden comment: KRL1632E-M-R010-F-T5)
R103  value 0.01R  Package: 1206  Tolerance: 1%  Power: 0.75W  [RES_C_1206_SHUNT]  (hidden comment: KRL1632E-M-R010-F-T5)
R105  value 0.01R  Package: 1206  Tolerance: 1%  Power: 0.75W  [RES_C_1206_SHUNT]  (hidden comment: KRL1632E-M-R010-F-T5)
U6  value PAC1934  [UQFN-16_4X4_EP2.6X2.6]  (hidden comment: PAC1934 UQFN-16)

### Blocks framed on the sheet
POWER MEASUREMENT 12V AND 5V FPGA: C130-C133 R54 R57 R60 R79 R80#1 R81#1 R83 R103 R105 U6

### Ports
PAC1934_INT_PE2 (bidir, see 11)

### Nets
+3.3V: R103.2
+3.3V_SENSE: R103.1
+5V_AI: R105.2
+5V_AI_eFUSE: R105.1
+5V_FPGA: R83.2
+5V_FPGA_eFUSE: R83.1
+5V_SAMA7: R81#1.2
+5V_SAMA7_eFUSE: R81#1.1
GND: C130.2 C131.2 C132.2 C133.2 U6.3(GND) U6.17(EP)  [project net AGND]
VDD_3V3: C130.1 C131.1 C132.1 C133.1 R54.1 R57.1 R60.1 R79.1 R80#1.2 U6.2(VDD) U6.15(VDD/IO)
SAM7_FLEX1_I2C_SCL: R54.2 U6.4(SM_CLK) ; off-sheet SAM7_FLEX1_I2C_SCL  [project net SAM_RTC_I2C_SCL]
SAM7_FLEX1_I2C_SDA: R57.2 U6.5(SM_DATA) ; off-sheet SAM7_FLEX1_I2C_SDA  [project net SAM_RTC_I2C_SDA]
SENSE_3.3V_N: R103.4 U6.7(SENSE3-)
SENSE_3.3V_P: R103.3 U6.8(SENSE3+)
SENSE_5V_AI_N: R105.4 U6.9(SENSE4-)
SENSE_5V_AI_P: R105.3 U6.10(SENSE4+)
SENSE_5V_FPGA_N: R83.4 U6.14(SENSE2-)
SENSE_5V_FPGA_P: R83.3 U6.13(SENSE2+)
SENSE_5V_SAMA7_N: R81#1.4 U6.12(SENSE1-)
SENSE_5V_SAMA7_P: R81#1.3 U6.11(SENSE1+)
NetR60_2: R60.2 U6.16(~{PWRDN})
NetR79_2: R79.2 U6.1(SLOW/~{ALERT}) ; port PAC1934_INT_PE2
NetR80#1_1: R80#1.1 U6.6(ADDRSEL)

### Layout directives
net class POWER: +3.3V, +5V_AI, +5V_FPGA, +5V_SAMA7
differential pair; net class DIFF100; differential pair class DIFF100: SENSE_3.3V_N, SENSE_3.3V_P, SENSE_5V_AI_N, SENSE_5V_AI_P, SENSE_5V_FPGA_N, SENSE_5V_FPGA_P, SENSE_5V_SAMA7_N, SENSE_5V_SAMA7_P

### Notes on the sheet
- Project:
- Sub-system:
- Design by:
- Sheet title:
- Sheet
- of
- Checked by:
- Approved by:
- Revision:
- Document No:
- Size:
- Date:
- A3

### Library data of the parts
C130 C131 = _CAP_C_High_2: CAP
C132 C133 = _CAP_C_2: CAP
R54 R57 R60 R79 R80#1 = _RES_B_2: RES
R81#1 R83 R103 R105 = RSMT1316: Shunt; Manufacturer 1: SUSUMU; Description_: RES SHUNT MF 0.01R 1% 0.75W SMD 1206; Dev Tools Status: Design; Temperature Coeffcient: 50ppm/C; Current: 8A; Owner: Ciprian Abramov; Populated: YES; MCHP-ID: RSMT1316; Revision: 1; Symbol: Shunt 4 Pin; Status: MCL Design; ComponentLink1URL: https://chn-vm-apps.microchip.com/mchprepo/parts/Datasheets/n_catalog_partition09_en.pdf; ComponentLink1Description: SVN Datasheet; ComponentLink2URL: C:\ALTIUM_WORK\00001_MCHP-CDB\Datasheets\n_catalog_partition09_en.pdf; ComponentLink2Description: Local Datasheet; ComponentLink3URL: C:\ALTIUM_WORK\00001_MCHP-CDB\Library\LibraryRefs\Shunt 4 Pin.SchLib; ComponentLink3Description: Open Symbol; ComponentLink4URL: C:\ALTIUM_WORK\00001_MCHP-CDB\Library\Footprints\RES_C_1206_SHUNT.PcbLib; ComponentLink4Description: Open Footprint; ComponentLink5Description: Open Footprint 2; ComponentLink6Description: Open Footprint 3; ComponentLink7Description: Open Footprint 4; Operating Temperature: -55C to +155C; Category: Resistor; Type: RES SMD; Composition: MF; Manufacturer Part Number 1: KRL1632E-M-R010-F-T5; Supplier 1: Digi-Key; Supplier Part Number 1: 408-1570-1-ND; Quantity Override: 1
U6 = MIC8883: Manufacturer 1: Microchip Technology; Manufacturer Part Number 1: PAC1934T-I/JQ; Description_: MCHP ANALOG POWER CURRENT SENSE MONITOR PAC1934T-I/JQ UQFN-16; Dev Tools Status: Design; Owner: Ciprian Abramov; Populated: YES; MCHP-ID: MIC8883; Symbol: PAC1934 UQFN-16; Type: Power/Current Sensor; Status: MCL Design; Revision: 1; Category: MCHP-Analog; ComponentLink1Description: SVN Datasheet; ComponentLink2Description: Local Datasheet; ComponentLink3URL: C:\ALTIUM_WORK\00001_MCHP-CDB\Library\LibraryRefs\PAC1934 UQFN-16.SchLib; ComponentLink3Description: Open Symbol; ComponentLink4URL: C:\ALTIUM_WORK\00001_MCHP-CDB\Library\Footprints\UQFN-16_4X4_EP2.6X2.6.PcbLib; ComponentLink4Description: Open Footprint; ComponentLink5Description: Open Footprint 2; ComponentLink6Description: Open Footprint 3; ComponentLink7Description: Open Footprint 4; Supplier 1: Digi-Key; Supplier Part Number 1: PAC1934T-I/JQCT-ND; Quantity Override: 1

## Sheet CONNECTOR_IN.SchDoc
size 420 x 297 mm; SheetNumber: 7; SheetTotal: 34
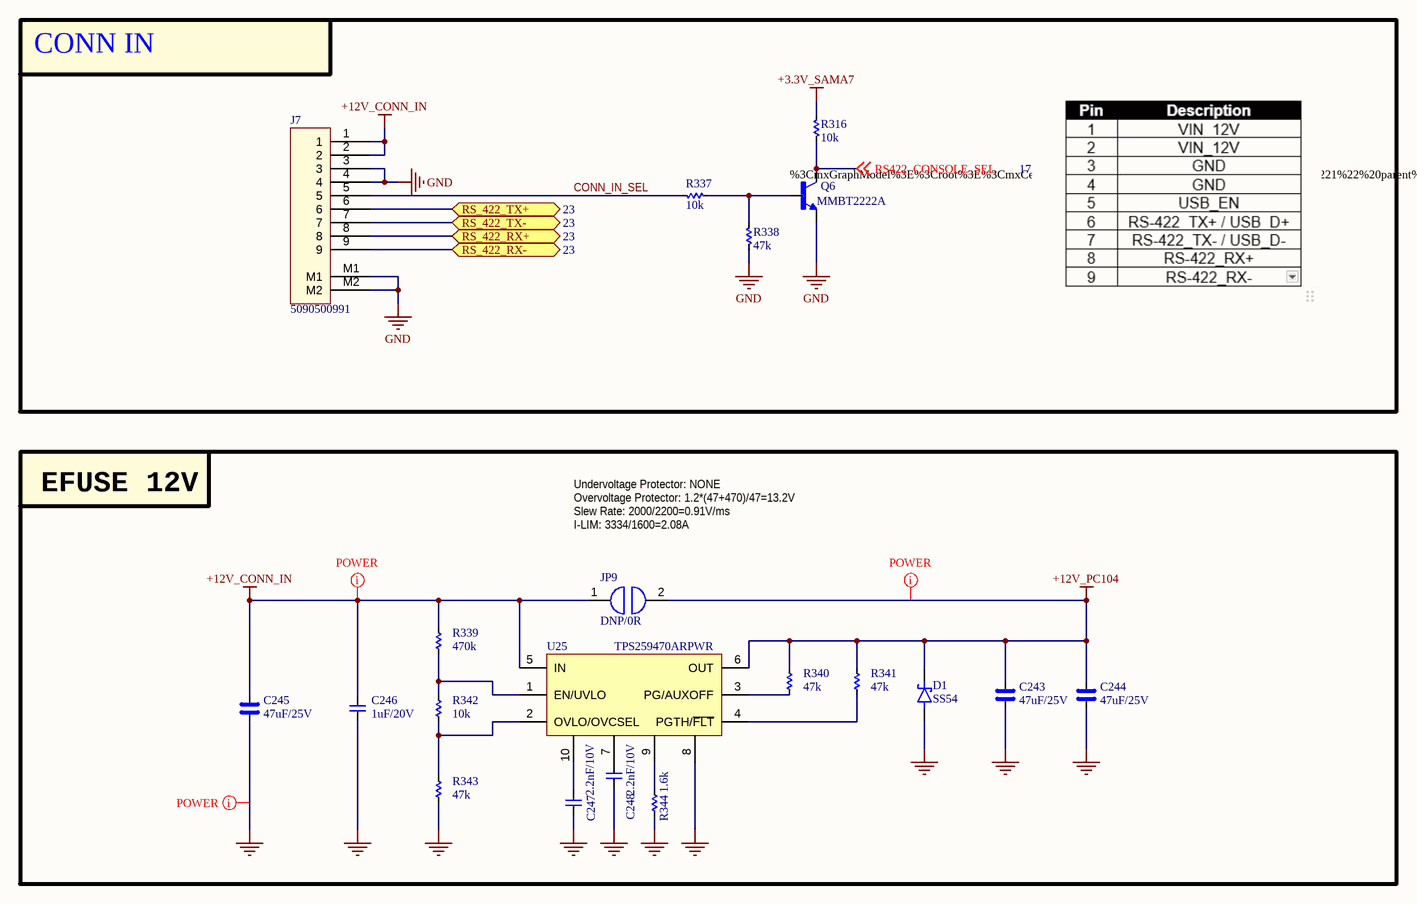
[diagram p6: CONNECTOR_IN.SchDoc]

### Parts
C243  47uF/25V  [CAP_C_3225X80]
C244  47uF/25V  [CAP_C_3225X80]
C245  47uF/25V  [CAP_C_3225X80]
C246  1uF/20V  [CAP_C_1005X50_L]
C247  2.2nF/10V  [CAP_C_1005X50_L]
C248  2.2nF/10V  [CAP_C_1005X50_L]
D1  SS54  [DO-214AC_SMA]
J7  5090500991  [MOLEX_5040500991]
JP9  DNP/0R  [JUMPER_1608]
Q6  MMBT2222A  [SOT95P240X120-3N]
R316  10k  [RES_C_1005x30_L]
R337  10k  [RES_C_1005x30_L]
R338  47k  [RES_C_1005x30_L]
R339  470k  [RES_C_1005x30_L]
R340  47k  [RES_C_1005x30_L]
R341  47k  [RES_C_1005x30_L]
R342  10k  [RES_C_1005x30_L]
R343  47k  [RES_C_1005x30_L]
R344  1.6k  [RES_C_1005x30_L]
U25  TPS259470ARPWR  [VQFN-HR-10]

### Blocks framed on the sheet
CONN IN: J7 Q6 R316 R337 R338
EFUSE 12V: C243-C248 D1 JP9 R339-R344 U25

### Ports
RS_422_RX+ (bidir, see 23), RS_422_RX- (bidir, see 23), RS_422_TX+ (bidir, see 23), RS_422_TX- (bidir, see 23)

### Nets
+3.3V_SAMA7: R316.2
+12V_CONN_IN: C245.2 C246.2 J7.1 J7.2 JP9.1 R339.2 U25.5(IN)
+12V_PC104: C243.2 C244.2 D1.1(K) JP9.2 R340.2 R341.2 U25.6(OUT)
GND: C243.1 C244.1 C245.1 C246.1 C247.1 C248.1 D1.2(A) J7.3 J7.4 J7.M1 J7.M2 Q6.2(E) R338.1 R343.1 R344.1 U25.8  [project net AGND]
CONN_IN_SEL: J7.5 R337.1
RS422_CONSOLE_SEL: Q6.3(C) R316.1 ; off-sheet RS422_CONSOLE_SEL
RS_422_RX_N: J7.9 ; port RS_422_RX-
RS_422_RX_P: J7.8 ; port RS_422_RX+
RS_422_TX_N: J7.7 ; port RS_422_TX-
RS_422_TX_P: J7.6 ; port RS_422_TX+
NetC247_2: C247.2 U25.10
NetC248_2: C248.2 U25.7
NetQ6_1: Q6.1(B) R337.2 R338.2
NetR339_1: R339.1 R342.1 U25.1(EN/UVLO)
NetR340_1: R340.1 U25.3(PG/AUXOFF)
NetR341_1: R341.1 U25.4(PGTH/~{FLT})
NetR342_2: R342.2 R343.2 U25.2(OVLO/OVCSEL)
NetR344_2: R344.2 U25.9

### Layout directives
net class POWER: +12V_CONN_IN, +12V_PC104, AGND

### Notes on the sheet
- (near Q6) %3CmxGraphModel%3E%3Croot%3E%3CmxCell%20id%3D%220%22%2F%3E%3CmxCell%20id%3D%221%22%20parent%3D%220%22%2F%3E%3CmxCell%20id%3D%222%22%20parent%3D%221%22%20style%3D%22shape%3Dimage%3BverticalLabelPosition%3Dbottom%3BlabelBackgroundColor%3Ddefault%3BverticalAlign%3Dtop%3Baspect%3Dfixed%3BimageAspect%3D0%3Bimage%3Ddata%3Aimage%2Fpng%2CiVBORw0KGgoAAAANSUhEUgAAAUsAAAEoCAYAAADR19NqAAAAAXNSR0IArs4c6QAAAARnQU1BAACxjwv8YQUAAAAJcEhZcwAADsMAAA7DAcdvqGQAAChzSURBVHhe7d1RaBtX%2Fi%2Fwr%2B6F9KJI7V3WpVhurXXonwQHbruVvGQLW8mJl60vtrekenBgIz20D107m33wg82yNYsLu9KDX4zl7EOyYBU2eVBLKxVSWDeWs2w3IIn%2F5sGiZkO8ShuJUi9tI8WQwL1zH%2F4%2Bc2eORvLYkVPp6PsBQTJzNNZoRl%2FNmRmdn0PTNA1ERNTQf5MnEBFRLYYlEZENDEsiIhsYlkRENjAsiYhsYFgSEdnAsCQisoFhSURkA8OSiMgGhiURkQ0MSyIiGxiWREQ2MCyJiGxgWBIR2cCwJCKygWFJRGQDw5KIyAaGJRGRDQxLIiIbGJZERDa0TFjGYjEEg0FUq1V5FmKxGBwOh%2F44fPgw8vm83Ex55XIZkUjE8j1qllgshkgkAgBIp9NwOByIxWJyM10%2Bn8fhw4cbtpGl02l4vV6Uy2V5VlPJ%2B43D4aj5u9VqFcFgUJ9fbx8U0um05f5XLpfh9Xr15Yj3sN588ZDfN%2FGei0c6nTbN341Yn3rPy%2BfzePHFFy3f%2B0gkUvd9kqXT6Zr3qlwu48UXX6x5b1TRMmFpRWz4paUllEolaJoGTdNw5coV%2BP3%2Bmh1NdTMzMygWi%2FLkpsnn87h8%2BTKi0ag%2Bzel0Ih6PW77X1WoVU1NT2N7elme1hEKhgHA4rO83mqahWCyiu7sb2Hn9IyMj8Hq90DQNlUoFADA5OSkt6b%2BUy2WcO3dOnoxyuYwTJ05gYmICmqahVCohk8mY3jOx%2F%2BZyOdPrmZ6e1tuk02mMj4%2FrbVKpFMbHx%2FcUPpOTk1hbW5MnAzuv8%2FTp0%2Fj666%2FlWYhEIshkMvrrXFxcxIkTJywDM5%2FPY3x8XJ6M7u5uvPPOO5iammr4hdOuWjosxU67vr6u7%2BAAMDo6ilwuh7m5ubrfoLQ3IvjOnDljeq8B4KWXXsLVq1drPgCrq6sAgN7eXtP0VlCtVlEsFtHf3y%2FP0q2uriKbzeL8%2BfMAAJfLhfn5eayurloG1MzMDO7cuSNPRiKRAACEw2FgJzQWFxextLSkh02pVILD4YDH4zE9V6hWq5ifn0coFILP5wN29vNQKISFhQW5eQ1x5CpeiyydTsPj8Vi%2B%2Fnw%2Bj2QyicXFRX3bj46OIhgMYmZmxtQ2FovB7%2FfX%2FYIcHBwEDPuGSlo2LMUGnJqagsvlkmfD5%2FMhFAphfn6%2B5kNsJLqJ9bpZu80Xpwd%2B%2B9vf6m3kbpidNqLdbl0suU0sFtOPsBOJBNbW1vDMM8%2Foy5a7d3L3KRaL4bXXXtO7mnL3UNjY2MDt27cxNDQkz8Krr76K27dvY2NjwzQ9mUxaHmFA6tLVW1cjeTsYX6d4T4zL2O0UQaVSwTfffGO5PkKhUMDAwACOHj2qTzt69CiOHDmClZUVU9t0Oo1MJoMLFy6YpmNnOcFg0PQl4%2Ff7AQC5XK5uG6NKpYLNzU2EQiHT9FAohEwmY3mEJ4gj276%2BPqyursLpdJrmp9NpjI2NIRqNmnoNQqlUQldXl%2F6ahf7%2BfhSLRf3zEIvFMDMzg1QqpX8xyFwuF4aHh3f9XLajlg3LehvQKBQKYXNzU%2B8%2BydLpNPx%2BP65cuaJ3e7xeL0ZGRlCtVvX5s7Ozpm6YmC%2Bsra3h888%2F19sMDAzUdDV2axOLxTA3N6d3sXK5HMbHx00f9kgkYjrlUCqVsLS0hHg8jkwmg3A4jEAggC%2B%2F%2FBI%2Bnw%2F5fB7PP%2F88gsGgvn7BYLCm%2B%2FThhx9ieHgYmqZheXlZn260srKCI0eOmIJDOHbsGI4cOYJSqaRPK5fLKBaL%2BNGPfmRqK4Ld2KVLpVIYGxurG5j5fB6vvPKKaTsUi0X9i2t6ehrhcFj%2FAIrucDgcNnVjjXK5HG7evAm%2F31%2F3i6RQKMDr9Vp%2BGRcKBf3f4u9NTEygp6fH1G63I9hCoYBqtYqrV68ikUjUfBEK4r2yOvLc2toyvfey7u5uFItFZDIZuN1ueTZGR0druvx2GT9f09PT0DQNo6OjcjOToaEhyy%2FXdteyYWncWRtptCMlk0mEw2HTxl1eXkYmkwEAzM%2FPmz5wohuWzWZN3Yje3l79G9nlcmFqagrZbNa0MzRqUy6XsbS0hNnZWb2L5fP5MDs7q3fVyuUyMpmMqSskPgT1dvKFhQUMDAwgHo%2Fr08RrMHbHent76x4JYOcDf%2FXq1brB4Xa7MTw8jGQyqU%2FL5XLwer01R0qia%2Fv%2B%2B%2B%2BbunTGsJOJ9RCnXay2QzQaxebmJuLxuN41tDpKEsT%2Bk0qlGn6R2JFIJNDX11f3XOZuxFFjIBBApVLRvyzn5ubqHhk%2FTh6PB1tbW%2FpRsGD3MyjzeDxwOBx1P5ftqmXD8lGJ8Kn3jS92YHn%2B0aNHMTAwYAqGvr4%2By29so0Ztcrkctra2arqEQ0ND%2BhGkaGN1ZGFFHNHIAdfd3Y1gMGg6x9jotaHBe2HU39%2BvdwerhvNrskKhgK6urpr1CIVCNV8wMGyn4eFh03qI7SA%2BsN3d3ZiYmMDMzAwSiYTpS8WK1VGQ1RfJbvL5POLxOObn5y2%2FSOwwHvmJZchflt8l8V6fO3dOfy3pdHpP75OR2%2B1GX1%2FfvsO2VbVsWDb64BpZfTCNdlvObvObZXt729QldDgc8Pv9%2BPe%2F%2F6232W1drDyu1288B7exsYFvvvmm7imS3cLZyszMjOm9cbvdNVd1w%2BEwent7EQgE9AsJe7HXD3F156LX5OSk3iNopv7%2B%2FoY9o8fF5XLho48%2BQl9fn35UmEwmGx6522H3fW4XLRuW9boGRslkctcP5m4brN78ZoeQ0%2BmsuW1E0zTcv39f%2FyDu54NT7%2FXLR5yPShyxJpNJrKys4IUXXqh7ZFfvPHKjL4NoNFrz3sjn2cTV6LW1NdOph%2F2SL2DI8zY2NpDNZk1BPjY2pn%2FxxWIxuFwueL3eutvB7n7UqOsq3jf54p98MfJRuFwuZDIZ%2FX1fXl5GoVDY9fPViN11bxctG5a7Xe3e7Wr5bkcR9eaLD0gzN7QICPmDkDbcnF2vTT3iQyp%2F2Hc7%2FWCl3nshC4VCSCaTiMfjll1wNDhaqvfFVu9vl3eu8ouLQqJbmEqlEI1GMTc3V3O3gVEkEqkJE%2FmKc39%2Ff82pAeNdAT6fD%2Ffv3zeFdyqV0r%2F4RJAbT1EI4kve7%2FfrV%2FrlC1wFw9V48T4YT%2F9g530TV9HFqQXxMHbrH4XV66t3esQOO6d12pLWIqLRqBYIBLRKpaJPq1QqWiAQ0Hp7e7VSqaRPT6VSGgAtGo3q06yIdqlUSp8WjUb15cnLEX%2FP%2BDqsXlcqldKcTqeWy%2BX21Mb4%2F1KppPX29prWIRwOm9ZVvJ5wOKzPN%2F6dXC6nOZ1Ofb7VMqxemxWrdvI6iL9nXL68HlbbTN4OqVTKNF8sV34vxOuRt4v8fyvyMq2eI0%2BT328r8nuiGd4D8Tz5PdEstov8nlhNs%2FpbuxHrbVyukXH%2FF%2BT3QbN4vTJ5XzTK5XLac889t6fX3Q5aOiyN8wDoj73sQGLnEc%2BVdwB5vvxBsXpd8k5sp41oZ1wP44epXhvj6zG%2BVvFhEB9M0V5%2BHVavzYrVDi6vg1WYWAWDtvNhqre95LDULLaD%2FMGVlyHay9vLqNEyBbFOjdoYye%2BJIG8Hq9dlfE%2BM29BIBGajNo2Ida73PKuw1PbxPjQKS7v7XLtxaJqmyUeb1HmqOz%2F9Gx4ernurEtFuxH40NTW16%2F2Y7aZlz1nS4yXubbx8%2BfJ3fisLtS9xX%2Bx%2B7lZodTyyJJNYLIZCoVD3lz5E9ZTLZQwPD%2BPSpUsHcqvVd41hSURkA7vhREQ2MCyJiGxgWBIR2cCwJCKygWFJRGQDw5KIyAaGJRGRDQxLIiIbGJZERDYwLImIbGBYEhHZwLAkIrKBYUlEZENLjDrkcDjkSUSkgBaIl6bhkSURkQ0MSyIiGxiWREQ2tH1YrqysmGopGx%2F37t3D2bNn9bbr6%2BvQNA3r6%2BumZZA9Z8%2Bexb1792reZ%2FG4ePGi%2FJTvnNg%2FvvjiC5w8eVKevav19XV9vYzr34rrSger7cOyEbfbjXg8bgpMOjhvvPEGVlZW5Mlt6eTJk%2Fjiiy%2FQ398vz6IOpUxY3r17F6dOnYLD4YDD4cA777yDhw8fwu12IxAIAACOHz8Oh8OB48ePy0%2BnPbp06ZL%2BXjscDhQKBQDAT37yE8zNzcnNvzNDQ0NwOBx49tlnce3aNXn2nrz77rt48skn4XA48Oabb8qzSXHKhKUsk8ngq6%2B%2BAgD84Ac%2FACy64XNzc3jw4AEePHiAixcvmrqYqhwhPS6%2F%2BtWvcPfuXRw6dAgvv%2FyyPl3uult1h%2BVTKVZt5OXUO8XyxRdf6O3W19druuHG5aRSKcttfvbsWXzwwQfo6ekBdo6Y7927hz%2F%2B8Y91u%2BHi78vLkucbX5PVelDrUjYsg8Egnn76aQDAv%2F71L3m2yaFDh%2FDGG2%2FA7Xbr006dOlXzgaD6rl27hs8%2B%2BwwAcOzYMZw8eRJzc3O4ePGi6X3t6enBBx98oAfEysoKTp06pc8XbRKJhB6YVsupd4qlp6dHb7db%2FfPR0dGabS6H3G7qdddPnTpleW68v7%2FftL5utxt%2F%2BMMfar4cqPUoE5Y9PT345JNP9G%2Fst99%2BG4cOHcLdu3fx5z%2F%2FWW5eo1AowOFwIBwOo1KpAAB%2B%2FOMfy82oAflL6fXXX8ehQ4fwySefmLrrbrcbkUgEANDd3Q0Aehtx%2BuTpp59GMBg0LUecajl16hTu3r1rWo7w8OFDvPPOO3A4HBgaGjLNkxlP3YjTCMeOHcPdu3fx2muv4e7du8DOKYcnn3wSf%2Fvb36QlAL%2F5zW%2FQ09Nj%2BrtiHfr7%2B2u%2BcI3tPvnkEwAwrSu1LmXC0kqhULB1rurhw4d47733gJ3zUp9%2F%2FrnchPbopz%2F9KZ577jlg5yhLfImJIzARkuLoT7R5%2BeWX8cQTT%2BCJJ57A7OwsTp48iaeeegoA8PHHH%2BPatWu4du0ann32WctAvHXrFmZnZ03T6hHLA4D33nuvJqR3c%2FLkSRw7dgwA8Ne%2F%2FlX%2Fu7Ozs7h16xZg8YVrfH2ffvopHj58aJpPrUuZsJQv8Dh4IeexE%2BeG7Xjqqadw8uRJ%2FP73v9eP4GAITXEur6enB08%2B%2BaTpuc3w8OFDlEol%2Ff%2F%2F%2FOc%2F8eDBA1ObvZCPqnc7BUDtR5mwpO%2BeOFr87LPP9G4tLK6cOwxXp41HicbusOhi3717F%2Ffu3dOX1SyHDh2Cx%2BPR%2F%2F8f%2F%2FEfeOKJJ0xt9kL%2BohDvBamDYUlNsbKygv7%2Bfjx8%2BBCffvqp6XTGq6%2B%2BipMnT%2BoXQ8TVYvn%2F2Lm9SwRmd3c3rl27hm%2B%2F%2Fda0HFjc2bAfxuWJ86JfffUVMpmMqZ0chILxopbxlqm5uTk8%2F%2FzzAIC%2F%2F%2F3vpudQ%2B2JY0r688cYbpltlxBVe47k7cR5QXHz75JNP0NPTg0qlguXlZVy7dg0ff%2FwxUOe8pggaeTmijfFc837Iy4N0HlM4deoUHjx4gNdff900HQCWl5dRqVRw6NAhvP3226aLi4VCgfdjKoRhSU0hrvIaL7jMzs4iFouZLmJUKhVMTk7i3XffBQC8%2BeabuHTpkj4fhmWJoJmdncWbb76p36Ug2sRiMdsXc6yk02nTMi9duqT%2FzWvXruFPf%2FrTrhdgxI3qxtMO2Lm6z3PmitFaAAA%2B%2BHgsj7Nnz2r37t3TNE3TLl68WDOfj%2BY%2BVMIjSyIiGxiWREQ2sKwEER2YFoiXpmmZsGyBl9F0qq4XkR2q7f%2FshhMR2cCwJCKyoePCMhKJIBaLyZOphcVisZqfS8rbsFqtIhgMwuv1Wv4uO51O4%2FDhw8jn8%2Fr%2F5WWKRzqdlp9O1FlhGYvFkEgk5MnUosrlMrxeL65evYpKpaL%2FwieXy2Fubg7BYBDVatX0nDt37mBmZsY0rR6n04lcLmf6JVIul8P4%2BHhNGBN1RFiKow67HyL67lWrVZw5cwbBYBCZTAYul0uf5%2FP5cP36dWSzWayurpqeBwCJRGLfR4c%2Bnw9XrlzB3NycfhRKhE4Iy2q1ipGREWxubiKfz6O3t1duQi1oY2MDt2%2Ffxvnz5%2BVZAICjR48iFAqZRjoHgJ%2F%2F%2FOcIBAKYn5%2BvOeq0a3BwEAMDA1hYWJBnUQdTPixdLhcymQyKxSKHzWojKysrOHLkCI4ePSrPAna26%2FLycs1AvU899RTm5%2BeRzWYRj8dN8%2BxyuVzwer0oFov7DlxSj%2FJhSe1JHphiL3w%2BH0Kh0CN1peWaOkQMS2ob4oKP8cq11UUeAIhGo%2Bjq6sLU1JTlfKK9YlhSS7I6suvu7kaxWNSvXIfDYbmJrru7G4uLi1hbW9tXd%2FxRjmxJTQxLakn9%2Ff3IZrPY2NiQZ9k2OjqKcDiMpaUlU52f3VSrVRSLRQwPD5uuwlNnY1hSS2rWFeloNAoA%2BOUvfynPqmt1dRXZbLamciR1NoYltSSXy4XLly8jk8nU%2FCpHnLtMJBKYmppqePQnuuN25fN5jI%2BPY3Z2Fj6fT55NHYxhSS1LnKOcmJiAx%2BPRL%2Bp4PB4Eg0FomobR0VH5aTUGBwcRCATkydje3obf7zddMPL7%2Fbhy5Qqmp6fl5tThOETbAVJ1vYjsUG3%2F55ElEZENDEsiIhtaphtOROppgXhpmpYJyxZ4GU2n6noR2aHa%2Fs9uOBGRDQxLIiIbGJZERDZ0RFjK9VbqjVRD3x0xmr1xOxkfkUhEfoouEok03L5i2Y2W0ahNPp%2FH4cOHTTV8qPMoH5bpdBpjY2NIpVLQNA2VSgUAMDIywsBsQeFw2FQTR9upi5NMJmvq4ogQw85VV%2FHwer145plnmhJs5XIZp0%2BfRldXF27dusWfQHYw5cMymUwiHA7rP4tzuVz6SNpW9Vuo9fh8PszOzmJpaUn%2FjXi1WsXU1BRCoRCWl5dN7ePxOAYGBh55LMtyuYwTJ04AAG7cuMGR9juc8mG5vLxc82HyeDzo6uoyTaPW1t%2Ffj62tLZRKJcAwMpBVjR6Xy4Xf%2Fe53%2BOijjxoOstEIg5JkyoellVwuh62tLXg8HnkWtahCoYCuri59mxUKBQwMDNSt0RMMBvcdlKKyJBiUZNBxYVmtVjE%2FP9%2Fwg0atJZ%2FPY25uDhMTE3pwHdRI5t9%2B%2By1GRkawtraGYDDIoCRdx4Xl5OQkstks5ufn933kQQcnkUjUXAn3%2B%2F2YnZ19LMOmffjhh9jc3MSFCxeQSCRqLipR5%2BqosIxEIkgmk7h%2B%2FTqvarYo49XwUqmE3t5eBAIBTE5OmtpZ1ehpht7eXty4cQNvvfUWwuHwI1WIJLV0TFgyKNtPd3c33n%2F%2FfWSzWcuwbFSjJ51O7%2Bu%2BSGPXW1SIPH36tGmkdupMHRGWDMr2JW4bSiQSSKfT%2BvRGNXqadV5ahPXW1hZmZmbk2dRhlA%2FLWCzGoGxzk5OTCAQCOHfunH6EJ%2B6XTSaTNb%2B6aeZ5aWNY8%2FxlZ1M6LMvlMpaWlixrrTgcDu78bUIE49bWFs6cOaPfaO7z%2BfDll1%2BiWCyatmuxWMSXX35Z8%2BVodfHI4XCYjlitTE9PIxwOY2ZmhvtMB%2BN4lgdI1fUiskO1%2FV%2FpI0siomZhWBIR2dAy3XAiUk8LxEvTtExYtsDLaDpV14vIDtX2f3bDiYhsYFgSEdnQEWEpRtQW99XJNzHT42dVRsLq54lyyQjjQy4fYRSLxUxtvV5vzU8WI5FIw2WgQZtyuQyv1wuHjfs0SQ3Kh6UoCzA7O6sPzpDJZBiY36FyuYzjx4%2FD6%2FWaykFcuXIFfr%2B%2FJnwCgQAqlYqpbalUwubmZs1vxkWIXb161fSciYkJeDyemmXvhxjvcmtrC7lcTh%2BFn9SmfFgmEglgZzQb7Pzed3FxEZlMpuZIgx6PXC4H7AxUYTQ6OopwOIz5%2BfmaIzmZ2I7JZNJ0NDozM4O%2Bvr6aUdLFr3CMP5ncj2q1ipGREWSzWf6EtsMoH5bT09MoFoumQVwPauBYsqfR%2B7%2B8vIxMJmPrN91i1HRRaiKfzyOZTGJqasry%2Bb%2F%2B9a8faeRzBmVnUz4sZeL34sZRt%2BnxGhoa0st6PEq3WISkMTS7urrg9%2Fullv%2FlpZdeeqRtLgboYFB2po4JS3FBQXywRLecHj%2Bfz4fr16%2FD6XRibGzM1gUbWblcxrlz5xAKhfTganTE%2Bqh%2B8YtfIJFIPPKwb9S%2BOiYsXS4XMpkMNE3D4uIinn%2F%2B%2BZorr%2FT4%2BHw%2B3L9%2FH5qm6ecu19bW4Ha7a0b2EdONV7c9Hg%2BCwWBN5c6DsLa2hr%2F85S%2B4cOGC5UDE1Bk6JiyNGg0cS4%2Ff9PQ0NE1DpVJBIBAw1QeHdDVctOnt7a25QHRQpSacTieuX7%2BOt956y3IgYuoMHRmW1JpcLhempqZM9cFlLpcLly9fBgDT2JbYOXcpbuexIu633WvQGbveYiDi8fFx9kw6jPJhaXVTcaVSwebm5oEdiVB94txxo%2FtcjfXBrYjbhtbW1hCPx%2FXpPp8PoVCo7q1HCwsLDS8A2SHCuqurC1NTU5Z%2FhxSltYCDfBm5XE5zOp1aNBrVp4XDYa23t1crlUqmts12kOvVzlKplAbAtE00TdMqlYoWCARqtlUgENAqlYqprZjndDq1XC6nTyuVSlpvb2%2FNc6LRqAZAS6VS%2BrRGyxbqtRHrEA6HTdPp%2F1Nt%2F2%2BJtTnoN1UEJgANgOXOfxAOer3amQg1sU0A1ASf1iCsNMMyrL74wuGwadl22hgfIrAb%2FX0RwAxMa6rt%2Fxyi7QCpul5Edqi2%2Fyt%2FzpKIqBkYlkRENrRMN5yI1NMC8dI0LROWLfAymk7V9SKyQ7X9n91wIiIbGJZERDYwLImIbOi4sNzv74OpdVjV79ltmDdjzRwH6zDRPnRUWFarVUxNTWF7e1ueRW0oHA5j51do%2BsPr9eL48eOmUYvK5TJOnDiBiYkJaIY6TPJQcESNdFRYxuNxrK2tyZNJIfF4HH19fZiZmdGn1avDJA8FR9RIx4RlPp9HPB7HhQsX4HQ65dmkCDHMm7GQWaFQQDAYNJWUECMP1RvOjUjWEWEput9i0F9Sm7EmT7VaRbFYrDsc30GWoiC1dERYrq6uYnNzs2ZkbVKTx%2BNBV1eXPJnokSgflqKw1eLi4iNV9iOizqZ8WM7MzCAYDGJ0dFSeRYoqlUrY2tqSJxM9EqXDslwuI5PJIJFI6PfX%2Bf1%2BbG9vY2xsjPfaKcpYP9zlcsHr9dY9N1nvXCaRTOmw7O7uRrFYNN2Hl8vl4HQ6kUqlHksZVXq8qtUq5ufnTVe%2F%2B%2Fv7kclkTLcJiavgj1KPhzqL0mFJnWdycrLmYp64v1LceynOY09MTPA8NtnGsKS2ZTy9Ih7FYhHr6%2BumEOzu7saNGzeQyWTgcDjg8XgQDAYxPT1tWh5RIxzP8gCpul5Edqi2%2F%2FPIkojIBoYlEZENLdMNJyL1tEC8NE3LhGULvIymU3W9iOxQbf9nN5yIyAaGJRGRDR0RlrFYrOZ%2BPK%2FXy4Ff29R%2BykoI4rksK0J71RFhWSgUakoQFItF%2FnqjzcnbVKtTVsJocnKSo%2BXTvigflrsN%2FkpqsSorAUPBMlFigmivlA%2FLSqWCb775BkNDQ%2FIsUpBVWQlRsKyvrw%2Brq6ssK0L7onxY5nI53Lx5E36%2Fn%2BcrO4SxrAQMo09lMhm43W6pNZE9yoelGMcwlUrp57WCwSBOnDjBwFQUy0rQQVA%2BLKenp6FpmmmkdDF8F89fEZFdyoelFbfbjb6%2BvrqjZ1N7Y1kJOggdGZakNmNZCaJmUT4sI5FIzY3KlUoFm5ubCIVCprbU%2FqzKShA1g%2FJhef78eWSzWcTjcWDnw3TmzBn09fVhcHBQbk5tzqqsBFEzKB%2BWPp8P169fx9zcHBwOh37ryEcffQSXyyU3pzZit6wEUTNwiLYDpOp6Edmh2v6v%2FJElEVEzMCyJiGxomW44EamnBeKlaVomLFvgZTSdquulmv8s%2Fl95Uo0fetkJ2yvV9n%2BG5QFSdb1U85f1%2F4OtSv3t9D%2BdDgz%2Fr%2F8uT6ZdqLb%2FMywPkKrrpRqGZX03b97E9va2PLkup9OJF154AVBw%2F%2B%2BIvoVchoBDtLU3eXsaH%2FKvtQS5tEgkEpGbkIXt7W0cO3bM9mMvwdpulA%2FLarWKkZERYOdnjhqHaFOG3bISsVgMc3NzyOVy0DQNpVIJmUyGgUl7onxYrq6uYnNzE5cvX9Z%2FsSN%2BCpfL5aTW1O7kshLVahVXr17F7OwsfD4fsDMY8OLiomk0daLdKB%2BWyWSyZlAFMXK2cYxLUoNcVsLlciGTyWB6etrUzuPx4Pvf%2F75pGlEjSoelsViZ8ZwVz1mqTS4rYWVlZQUOh0NvS7ubnJys%2B%2BgESoelGIpNdMnEeS2es1TbbmUlyuUylpaWanoc1JgYuUtWb7pqlA5LIRwOm7phLCvRucQQfTDsB2SfHIzy%2F1XWEWEp1wxnWQm11SsrIe6M2NzcxI0bN3hUuU8iIDspKKF6WIpQpM5iVVaCQdlcnRaUUD0sXS4XhoeHcfXqVcuyEvIRJ7U%2Fq7ISDEpqBqXDEjvnKzc3N2vKSoh5pBarshJiGoOSHkVH%2FDZcHFmsra0BAAKBwGMpK3HQ69Wp5O1pJG%2FbfD6PV155pe7P8FKpFP7Hkf%2FN34bX8Y9%2F%2FAP379%2BXJ9fldDrxwx%2F%2BEFBw%2F%2B%2BIsPyuqLpequFAGgdDtf1f%2BW44EVEzMCyJiGxomW44EamnBeKlaVomLFvgZTSdqutFZIdq%2Bz%2B74URENjAsiYhsYFgSEdmgdFg2qtXiYB2WttVou9arwZNOp03tYrGY3ISoIaXDUoySLcaxFI9oNAqn04nz58%2FLT6E2YrcGTz6fx%2Fj4OFKpFDRNQy6Xw9zcHAOT9kTpsLSSz%2BcxNzdnqslC6pBr8ADAwsICBgYGMDg4CADw%2BXyYnZ2tGWCFqJGOC0vxwemUofA7jVyDBwCWl5eRyWRMYwFwLFPaq44Ky3w%2Bj2QyiampqQMfRIO%2BO7vV4OF%2BQPvRUWG5sLBQMygsqadeDZ5yuQyv1wu%2F32%2FqlhPZ0TFhWS6XkclkMDExwTENO5QogaxpGoaHh2suBBE10jFhmcvlsLW1haGhIXkWKaZeDR4jMfAzi9aRXR0TloVCAV1dXawT3QGsavAQPaqOCkvWiVafXINH3MAu%2FwBBHH2yDhPZ1RFhWa1WUSwW%2BcHoAHINHnErUSKRQDqdBnb2h6mpKV7koT3piLAU1RxJLYlEoubnjsViEevr66YexOjoKFKpFMbGxuBwOOB2u%2BH1emvuvSRqhONZHiBV14vIDtX2%2F444siQielQMSyIiG1qmG05E6mmBeGmalgnLFngZTafqehHZodr%2Bz244EZENDEsiIhs6IizFaDPiXrx6pQeoPeynrIRROp3G4cOH9fEuiexQPiyr1SrOnDmDYDAITdNQqVQAACMjI7t%2BqKi12S0rYVQul3Hu3Dl5MtGulA%2FL1dVVZLNZvd6Oy%2BXC%2FPw8bt%2B%2BjY2NDbk5tTmrshJGMzMzuHPnjjyZaFfKhyV1FquyEkI6nUYmk8GFCxdM04nsUD4sBwcHMTAwgIWFBcAwiMKRI0dw9OhRuTkpwKqshOh%2BT0xMoKenx9CayB7lw1KUw8XOfV8cREF9VmUlEokE%2Bvr6WKiO9k35sMzn8zh8%2BDD6%2B%2Fv1iwAA4PV6614EILXk83nE43HMz8%2FzC5L2TfmwtCp9K8Y6ZEkBNRnLSojTLpOTk6wTT49E%2BbDEzlGk8YjC7Xajr6%2BPtaMVZSwrsbGxgWw2i5mZGf1ezLGxMWxvb8Pv9yMWi8lPJ7LUEWFZLBYt76nkyOnqkctK%2BHw%2B3L9%2F33QvZiqVgtPpRC6Xw%2FT0tLwIIkvKh%2BX58%2BeRzWYRj8f1aaL0gKjwR%2BqQy0oQNYvyYenz%2BXDr1i0sLS3p3bBMJoMbN26weFmbs1tWgqgZOETbAVJ1vYjsUG3%2FV%2F7IkoioGRiWREQ2tEw3nIjU0wLx0jQtE5Yt8DKaTtX1IrJDtf2f3XAiIhsYlkRENjAsiYhs6IiwlGvwRCIRuQm1kf3U4IlEIrbbEllRPizL5TJOnDih1%2BARJ5wZmO3Pbg2earWKYrGIaDRqassxTWkvlA9LMQyb8bfC0WgUmUwG6XTa0JJUYFWDp1KpYHNzkwOn0CNRPiwLhYI%2BAo3AIdrUZVWDp1Qq4Xvf%2Bx78fr%2FcnMg25cOyEYalmuQaPCsrK7h58yY8Hg%2FPV9K%2BKR%2BW%2Ff39yGQypnNYoltGapJr8BQKBX38So2142mflA%2FLoaEhbG1tmc5hsXZ0Z1leXsb9%2B%2Ff1shKidnw2m8Xq6qrcnMiS8mHp8%2Flw%2Ffp1JJNJvQv2s5%2F9DIFAQG5KijDW4KlHHH3yVAzZpXxYYicwjaUFBgcHeXVUYcYaPETNonxYxmKxmrK3uVwOW1tbGBoaMrWl9ifX4BE3sMv31ZZKJWiaxn2AbFM%2BLMU5S3G%2FZblcxrlz5xAKhVgaVUFyDR5xK1EikdDvqy2Xyzh9%2BjQGBwe5D5B9Wgs46JeRy%2BU0p9OpAdAAaNFoVG5yIA56vTpVpVLRAoGAvj2Nj0AgoFUqFfkpWiqVMrULh8NyE2oy1fZ%2Fjmd5gFRdLyI7VNv%2Fle%2BGExE1A8OSiMiGlumGE5F6WiBemqZlwrIFXkbTqbpeRHaotv%2BzG05EZAPDkojIBqXDMp%2FP48UXXzT9ekdIp9OmEgMcCLh97KeshFxapF47onqUDUvxK42vv%2F5anoV0Oo3x8XF9yK5UKoXx8XF9sFhqD3bLSsilRThEG%2B2HkmGZTqfh8Xgsh2ETvx02%2FtxxdHQUoVAICwsLcnNqM1ZlJRKJBPr6%2BhCPxwHDEG23b9%2FGxsaG4dlE9SkXlul0GmNjY4hGo6a6O4IY%2BDcUCpmmh0KhmkGCqf3IZSWq1SquXr2K4eFhU3Eyn8%2BHO3fu8LfhZJtyYTk6OgpN0zA9PS3PAgyjzYjSA0ZbW1t6KQJqX8ayEsZiZcZyuDxnSXulXFgSGctKiIGAx8bGEAqFeM6S9o1hSR0hGo1idHQUYFkJ2ieGJSnHqqyEPCo%2By0rQXnVcWIpyqFbnJru6uizPZVJ7MZaVkCs9Eu1Xx4Wl2%2B1GX18fksmkaXoymdRLEVD7kstKdHd3IxgM1mxvcfQpH3ES1dNxYWlVZiCdTiOZTOL8%2BfNyc2ozclkJADh%2F%2FjySyWRNWYmBgQEMDg4ank1UX8eFJXZuL0qlUhgbG4PD4cDY2BiuXLnCe%2B7aTCKRqPm5Y7FYxPr6uqmH4PP5cOvWLZw7dw4OhwMejwfBYBCZTMZ07yVRIxyi7QCpul5Edqi2%2F3fkkSUR0V4xLImIbGiZbjgRqacF4qVpWiYsW%2BBlNJ2q60Vkh2r7P7vhREQ2MCyJiGxQPizT6XTD4bgikQhisZg8mVrYXspKyOUk5Ae3PdmldFjm83mMj4%2FLk3WxWAyJREKeTG3CTlmJ7u5uFIvFmnbhcBi9vb0Ih8PyYoksKRuWsVgMfr8f29vb8iz9yMRYeoDUYFVWQpZOp5FIJLC4uMixAMg2JcMyFothZmYGqVSq5sihWq1iZGQEm5ubyOfz6O3tNc2n9iaXlZCJgTbC4bA%2BviWRHUqG5fT0NDRNs%2FwwuFwuZDIZFItFHlUoylhWQra6uopsNstBU2jPlAxL6mz1xrAUR5UDAwM4evSoPJuoIYYldYyNjQ1ks1lMTU1xtCHaM4YlKceqrAQArKys6COoE%2B0Vw5KUYywrYVQoFNDX1we3222aTmQHw5KUIpeVME4vFosYHh5mF5z2hWFJSrEqKwEAlUoFm5ubrLlD%2B8awpLZlt6wEGpzHJLKLQ7QdIFXXi8gO1fZ%2FHlkSEdnAsCQisqFluuFEpJ4WiJemaYmwJCJqdeyGExHZwLAkIrKBYUlEZAPDkojIBoYlEZENDEsiIhsYlkRENjAsiYhsYFgSEdnAsCQisoFhSURkA8OSiMiG%2Fwengy82j7CVogAAAABJRU5ErkJggg%3D%3D%3B%22%20value%3D%22%22%20vertex%3D%221%22%3E%3CmxGeometry%20height%3D%22285.5%22%20width%3D%22319.25%22%20x%3D%222420%22%20y%3D%223560%22%20as%3D%22geometry%22%2F%3E%3C%2FmxCell%3E%3C%2Froot%3E%3C%2FmxGraphModel%3E
- Undervoltage Protector: NONE
- Overvoltage Protector: 1.2*(47+470)/47=13.2V
- Slew Rate: 2000/2200=0.91V/ms
- I-LIM: 3334/1600=2.08A
- Project:
- Sub-system:
- Design by:
- Sheet title:
- Sheet
- of
- Checked by:
- Approved by:
- Revision:
- Document No:
- Size:
- Date:
- A3

### Library data of the parts
C243-C245 = _CAP_C_High_2: CAP High Value
C246-C248 = _CAP_C_2: CAP
D1 = DIODE SCHOTTKY
J7 = Header 9x1_2M
JP9 = JUMPER
Q6 = BJT_NPN_BEC: MF: Diotec Semiconductor; SnapEDA_Link: https://www.snapeda.com/parts/MMBT2222A/Diotec/view-part/?ref=snap; Package: SOT-23 Diotec; Value: *; MP: MMBT2222A; Check_prices: https://www.snapeda.com/parts/MMBT2222A/Diotec/view-part/?ref=eda
R316 R337-R344 = _RES_B_2: RES

## Sheet CONNECTOR_BUS.SchDoc
size 420 x 297 mm; SheetNumber: 8; SheetTotal: 34
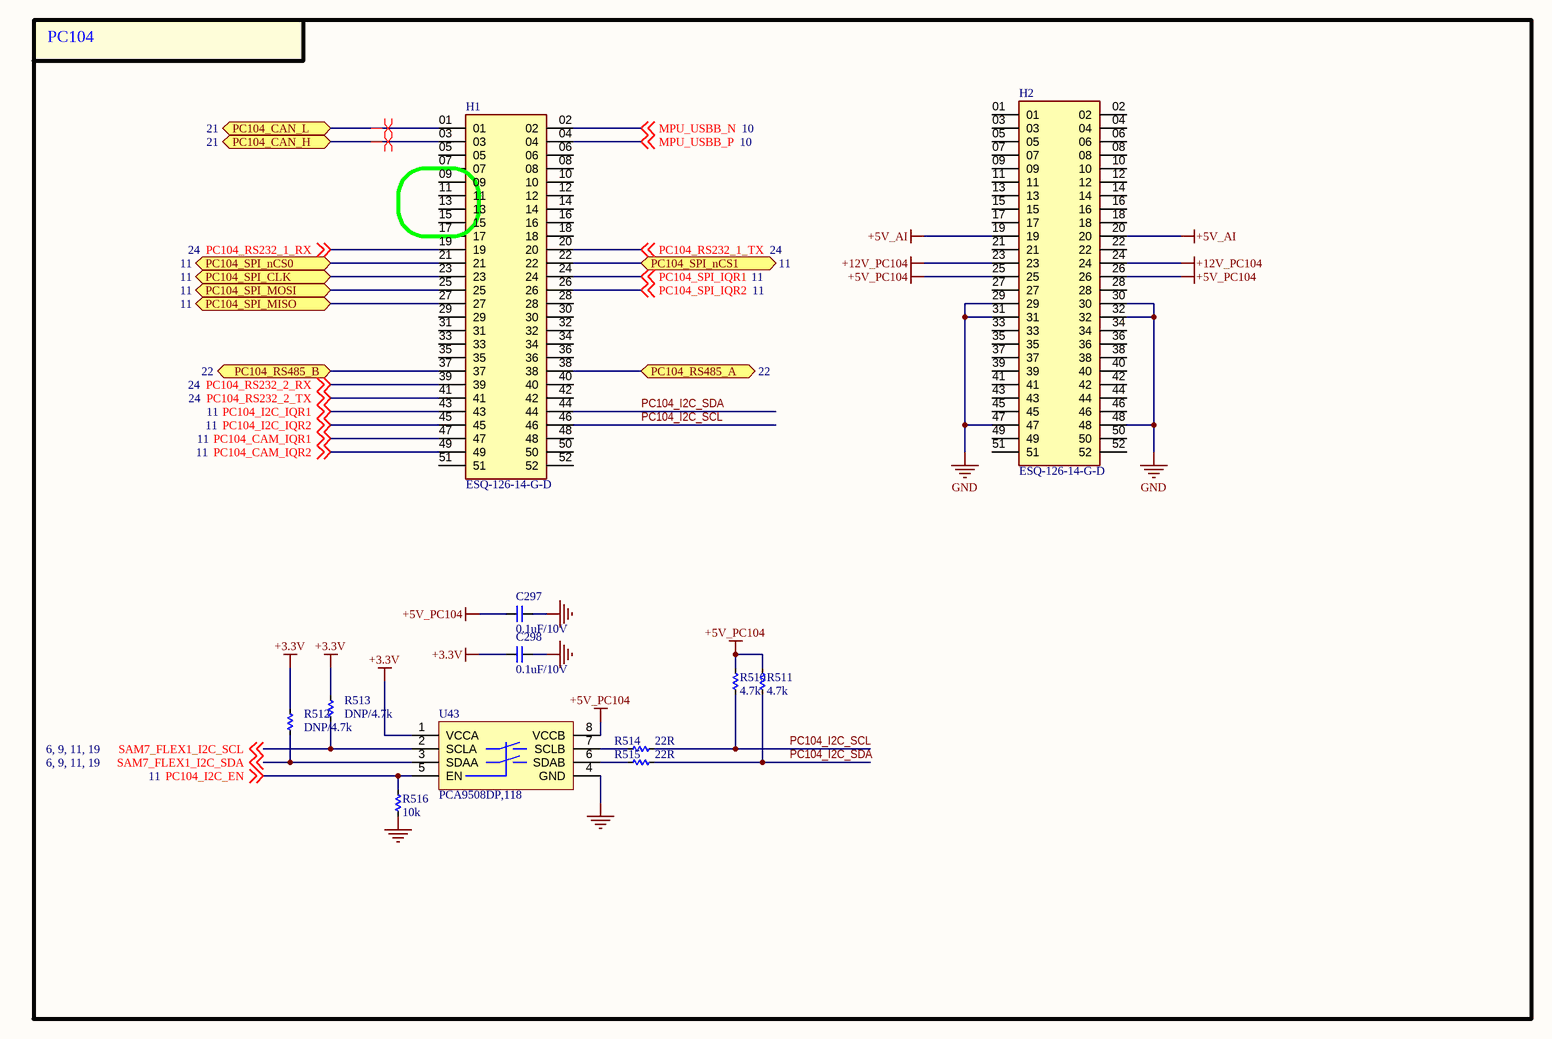
[diagram p7: CONNECTOR_BUS.SchDoc]

### Parts
C297  0.1uF/10V  [CAP_C_1005X50_L]
C298  0.1uF/10V  [CAP_C_1005X50_L]
H1  ESQ-126-14-G-D  [SAMTEC_ESQ-126-14-G-D]
H2  ESQ-126-14-G-D  [SAMTEC_ESQ-126-14-G-D]
R510  4.7k  [RES_C_1005X40]
R511  4.7k  [RES_C_1005X40]
R512  DNP/4.7k  [RES_C_1005X40]
R513  DNP/4.7k  [RES_C_1005X40]
R514  22R  [RES_C_1005X40]
R515  22R  [RES_C_1005X40]
R516  10k  [RES_C_1005X40]
U43  PCA9508DP,118  [TSOP8]

### Blocks framed on the sheet
PC104: C297 C298 H1 H2 R510-R516 U43

### Ports
PC104_CAN_H (bidir, see 21), PC104_CAN_L (bidir, see 21), PC104_RS485_A (bidir, see 22), PC104_RS485_B (bidir, see 22), PC104_SPI_CLK (bidir, see 11), PC104_SPI_MISO (bidir, see 11), PC104_SPI_MOSI (bidir, see 11), PC104_SPI_nCS0 (bidir, see 11), PC104_SPI_nCS1 (bidir, see 11)

### Nets
+3.3V: C298.2 R512.1 R513.1 U43.1(VCCA)
+5V_AI: H2.19 H2.20
+5V_PC104: C297.2 H2.25 H2.26 R510.1 R511.1 U43.8(VCCB)
+12V_PC104: H2.23 H2.24
GND: C297.1 C298.1 H2.29 H2.30 H2.31 H2.32 H2.47 H2.48 R516.2 U43.4(GND)  [project net AGND]
MPU_USBB_N: H1.02 ; off-sheet MPU_USBB_N
MPU_USBB_P: H1.04 ; off-sheet MPU_USBB_P
PC104_CAM_IQR1: H1.47 ; off-sheet PC104_CAM_IQR1
PC104_CAM_IQR2: H1.49 ; off-sheet PC104_CAM_IQR2
PC104_CAN_H: H1.03 ; port PC104_CAN_H
PC104_CAN_L: H1.01 ; port PC104_CAN_L
PC104_I2C_EN: R516.1 U43.5(EN) ; off-sheet PC104_I2C_EN
PC104_I2C_IQR1: H1.43 ; off-sheet PC104_I2C_IQR1
PC104_I2C_IQR2: H1.45 ; off-sheet PC104_I2C_IQR2
PC104_I2C_SCL: H1.46 R510.2 R514.2
PC104_I2C_SDA: H1.44 R511.2 R515.2
PC104_RS232_1_RX: H1.19 ; off-sheet PC104_RS232_1_RX
PC104_RS232_1_TX: H1.20 ; off-sheet PC104_RS232_1_TX
PC104_RS232_2_RX: H1.39 ; off-sheet PC104_RS232_2_RX
PC104_RS232_2_TX: H1.41 ; off-sheet PC104_RS232_2_TX
PC104_SPI_IQR1: H1.24 ; off-sheet PC104_SPI_IQR1
PC104_SPI_IQR2: H1.26 ; off-sheet PC104_SPI_IQR2
SAM7_FLEX1_I2C_SCL: R513.2 U43.2(SCLA) ; off-sheet SAM7_FLEX1_I2C_SCL  [project net SAM_RTC_I2C_SCL]
SAM7_FLEX1_I2C_SDA: R512.2 U43.3(SDAA) ; off-sheet SAM7_FLEX1_I2C_SDA  [project net SAM_RTC_I2C_SDA]
NetH1_21: H1.21 ; port PC104_SPI_nCS0
NetH1_22: H1.22 ; port PC104_SPI_nCS1
NetH1_23: H1.23 ; port PC104_SPI_CLK
NetH1_25: H1.25 ; port PC104_SPI_MOSI
NetH1_27: H1.27 ; port PC104_SPI_MISO
NetH1_37: H1.37 ; port PC104_RS485_B
NetH1_38: H1.38 ; port PC104_RS485_A
NetR514_1: R514.1 U43.7(SCLB)
NetR515_1: R515.1 U43.6(SDAB)

Not connected (* = marked no-connect by the designer): H1 05 06 07 08 09 10 11 12 13 14 15 16 17 18 28 29 30 31 32 33 34 35 36 40 42 48 50 51 52; H2 01 02 03 04 05 06 07 08 09 10 11 12 13 14 15 16 17 18 21 22 27 28 33 34 35 36 37 38 39 40 41 42 43 44 45 46 49 50 51 52

### Layout directives
differential pair; net class DIFF100; differential pair class DIFF100: PC104_CAN_H, PC104_CAN_L

### Notes on the sheet
- Project:
- Sub-system:
- Design by:
- Sheet title:
- Sheet
- of
- Checked by:
- Approved by:
- Revision:
- Document No:
- Size:
- Date:
- A3

### Library data of the parts
C297 C298 = _CAP_C_2: CAP CHIP
H1 H2 = ESQ-126-14-G-D: CONN SOCKET 52POS 0.1 GOLD PCB; MF: Samtec; MP: ESQ-126-14-G-D; Price: None; Package: None; Value: *; Availability: Unavailable
R510-R516 = _RES_B_2: RES